# Altium project SAMR21_Xplained_Pro.PrjPCB (part 1 of 2)
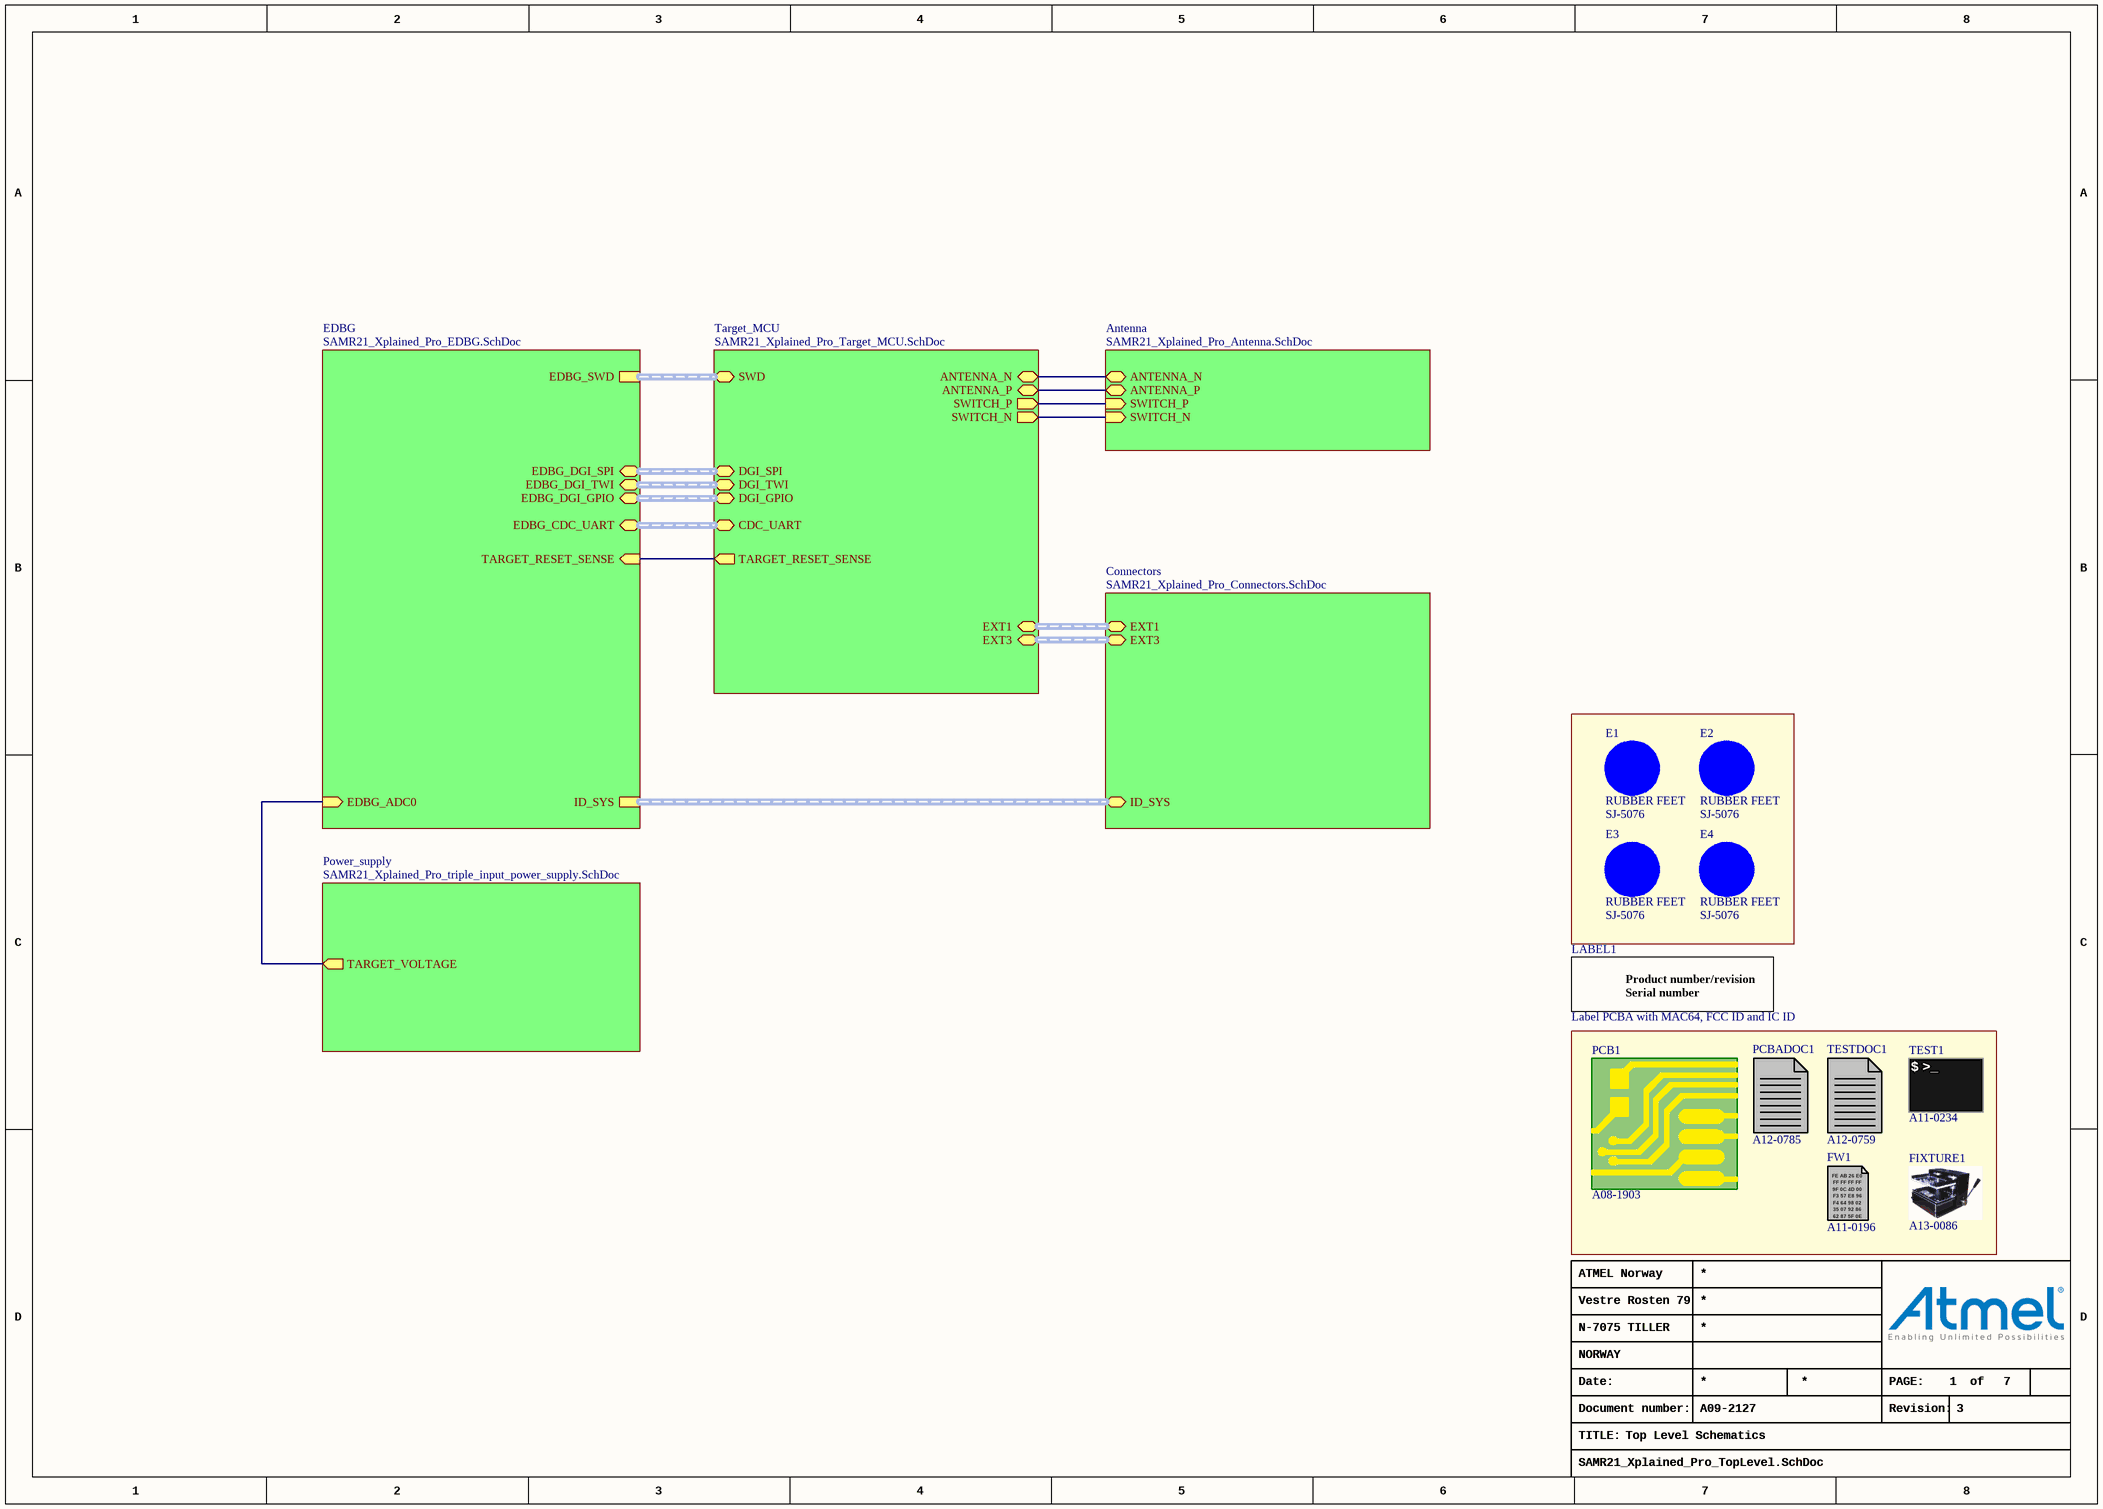
[diagram p0: SAMR21_Xplained_Pro_TopLevel.SchDoc]
7 sheets, 160 parts. Net scope: hierarchical (ports join the sheet entries above them; power ports are global).
Board file: SAMR21_Xplained_Pro.PcbDoc
Sheets:
  SAMR21_Xplained_Pro_TopLevel.SchDoc
    Target_MCU = SAMR21_Xplained_Pro_Target_MCU.SchDoc
      Crystals = SAMR21_Xplained_Pro_Crystals.SchDoc
    EDBG = SAMR21_Xplained_Pro_EDBG.SchDoc
    Connectors = SAMR21_Xplained_Pro_Connectors.SchDoc
    Power_supply = SAMR21_Xplained_Pro_triple_input_power_supply.SchDoc
    Antenna = SAMR21_Xplained_Pro_Antenna.SchDoc

## Sheet SAMR21_Xplained_Pro_TopLevel.SchDoc: Top Level Schematics
size A3; Organization: ATMEL Norway; Address1: Vestre Rosten 79; Address2: N-7075 TILLER; Address3: NORWAY; DocumentNumber: A09-2127; Revision: 3; SheetNumber: 1; SheetTotal: 7; PageSetup: Record=PageOptions|CenterHorizontal=True|CenterVertical=True|PrintScale=1.01|XCorrection=1.00|YCorrection=1.00|PrintKind=1|BorderSize=5000000|LeftOffset=0|BottomOffset=0|Orientation=2|PaperLength=1000|PaperWidth=1000|Scale=100|PaperSource=7|PrintQuality=-4|MediaType=1|DitherType=10|PaperKind=Letter|PrintScaleMode=1

### Parts
E1  RUBBER FEET  value SJ-5076  [AP8-00192]
E2  RUBBER FEET  value SJ-5076  [AP8-00192]
E3  RUBBER FEET  value SJ-5076  [AP8-00192]
E4  RUBBER FEET  value SJ-5076  [AP8-00192]
FIXTURE1  AN: A13-0086  (hidden comment: JIG)  (mechanical)
FW1  AN: A11-0196  (hidden comment: FW)  (mechanical)
LABEL1  value Label PCBA with MAC64, FCC ID and IC ID  [AP8-00317]  (hidden comment: PCBA_LABEL)
PCB1  AN: A08-1903  (hidden comment: PCB)  (mechanical)
PCBADOC1  AN: A12-0785  (hidden comment: PCBADOC)  (mechanical)
TEST1  AN: A11-0234  (hidden comment: TEST)  (mechanical)
TESTDOC1  AN: A12-0759  (hidden comment: TESTDOC)  (mechanical)

### Sub-sheets
Antenna = SAMR21_Xplained_Pro_Antenna.SchDoc: ANTENNA_N (bidir), ANTENNA_P (bidir), SWITCH_P (in), SWITCH_N (in)
Connectors = SAMR21_Xplained_Pro_Connectors.SchDoc: ID_SYS (harness ID_SYS), EXT1 (harness EXT), EXT3 (harness EXT)
EDBG = SAMR21_Xplained_Pro_EDBG.SchDoc: ID_SYS (harness ID_SYS), EDBG_SWD (harness SWD), EDBG_CDC_UART (harness CDC_UART), EDBG_DGI_TWI (harness DGI_TWI), EDBG_DGI_SPI (harness DGI_SPI), EDBG_DGI_GPIO (harness DGI_GPIO), TARGET_RESET_SENSE (in), EDBG_ADC0 (in)
Power_supply = SAMR21_Xplained_Pro_triple_input_power_supply.SchDoc: TARGET_VOLTAGE (out)
Target_MCU = SAMR21_Xplained_Pro_Target_MCU.SchDoc: SWD (harness SWD), DGI_SPI (harness DGI_SPI), DGI_TWI (harness DGI_TWI), DGI_GPIO (harness DGI_GPIO), CDC_UART (harness CDC_UART), TARGET_RESET_SENSE (out), EXT3 (harness EXT), EXT1 (harness EXT), ANTENNA_N (bidir), ANTENNA_P (bidir), SWITCH_P (out), SWITCH_N (out)

### Nets
EDBG_ADC0: sheet EDBG/EDBG_ADC0, sheet Power_supply/TARGET_VOLTAGE
PA09_RFCTRL1: sheet Target_MCU/SWITCH_N, sheet Antenna/SWITCH_N
PA12_RFCTRL2: sheet Target_MCU/SWITCH_P, sheet Antenna/SWITCH_P
RF_N: sheet Target_MCU/ANTENNA_N, sheet Antenna/ANTENNA_N
RF_P: sheet Target_MCU/ANTENNA_P, sheet Antenna/ANTENNA_P
TARGET_RESET_SENSE: sheet Target_MCU/TARGET_RESET_SENSE, sheet EDBG/TARGET_RESET_SENSE

Not connected (* = marked no-connect by the designer): E1 1(FIDUCIAL); E2 1(FIDUCIAL); E3 1(FIDUCIAL); E4 1(FIDUCIAL)

### Buses and harness runs
harness sheet Connectors/EXT1 = sheet Target_MCU/EXT1
harness sheet Connectors/EXT3 = sheet Target_MCU/EXT3
harness sheet Connectors/ID_SYS = sheet EDBG/ID_SYS
harness sheet EDBG/EDBG_CDC_UART = sheet Target_MCU/CDC_UART
harness sheet EDBG/EDBG_DGI_GPIO = sheet Target_MCU/DGI_GPIO
harness sheet EDBG/EDBG_DGI_SPI = sheet Target_MCU/DGI_SPI
harness sheet EDBG/EDBG_DGI_TWI = sheet Target_MCU/DGI_TWI
harness sheet EDBG/EDBG_SWD = sheet Target_MCU/SWD

### Notes on the sheet
- Date:
- PAGE:
- of
- TITLE:
- Document number:
- Revision:
- (in symbol A08-1911) / Product number/revision / Serial number
- (in symbol A11-0196) FE AB 26 E0; FF FF FF FF; 9F 0C 4D 00; F3 57 E8 96; F4 64 98 02; 35 07 92 86; 62 87 5F 0E
- (in symbol A11-0234) $ >_

### Library data of the parts
E1-E4 = A08-0053: 2.8mm adhesive feet,diam 8.0mm; PartGroup: Mechanical devices,Mounting accessories; Manufacturer: 3M; AN: A08-0053; Height: 2,79999995231628; MPN: SJ-5076
FIXTURE1 = A13-0086: Xplained PRO MCU board Jupiter Test Fixture; PartGroup: Test Equipment,Test Fixtures; Manufacturer: ESCATEC; Value: Xplained PRO MCU board Jupiter Test Fixture; MPN: Xplained PRO MCU board Jupiter Test Fixture
FW1 = A11-0196: EDBG secured firmware; PartGroup: Software,Firmware,Tools; Manufacturer: ATMEL; Value: EDBG secured firmware
LABEL1 = A08-1911: Label for use on wireless PCBA that needs 64 bit MAC, FCC ID and IC ID; PartGroup: Mechanical devices,Packaging materials,Printed Labels; Manufacturer: ACT Logimark AS; MPN: 505462; AN: A08-1911
PCB1 = A08-1903: SAMR21 Xplained Pro PCBA documentation; PartGroup: Mechanical devices,Printed circuit boards; Manufacturer: ATMEL; Value: SAMR21 Xplained Pro PCB documentation
PCBADOC1 = A12-0785: SAMR21 Xplained Pro PCBA documentation; PartGroup: Documentation,PCBA Documents,Atmel; Manufacturer: ATMEL; Value: A09-2127 PCBA Files
TEST1 = A11-0234: Fixture test for SAMR21 Xplained Pro; PartGroup: Software,Test software,Starter Kit; Manufacturer: ATMEL; Value: SAMR21 Xplained Pro test
TESTDOC1 = A12-0759: SAMR21 Xplained Pro test Instructions; PartGroup: Documentation,Procedures,Test Instructions; Manufacturer: ATMEL; Value: SAMR21 Xplained Pro test Instructions

## Sheet SAMR21_Xplained_Pro_Target_MCU.SchDoc: Target MCU
size A3; Organization: ATMEL Norway; Address1: Vestre Rosten 79; Address2: N-7075 TILLER; Address3: NORWAY; DocumentNumber: A09-2127; Revision: 3; SheetNumber: 2; SheetTotal: 7; PageSetup: Record=PageOptions|CenterHorizontal=True|CenterVertical=True|PrintScale=1.01|XCorrection=1.00|YCorrection=1.00|PrintKind=1|BorderSize=5000000|LeftOffset=0|BottomOffset=0|Orientation=2|PaperLength=1000|PaperWidth=1000|Scale=100|PaperSource=7|PrintQuality=-4|MediaType=1|DitherType=10|PaperKind=A3 (297 x 420 mm)|PrintScaleMode=1
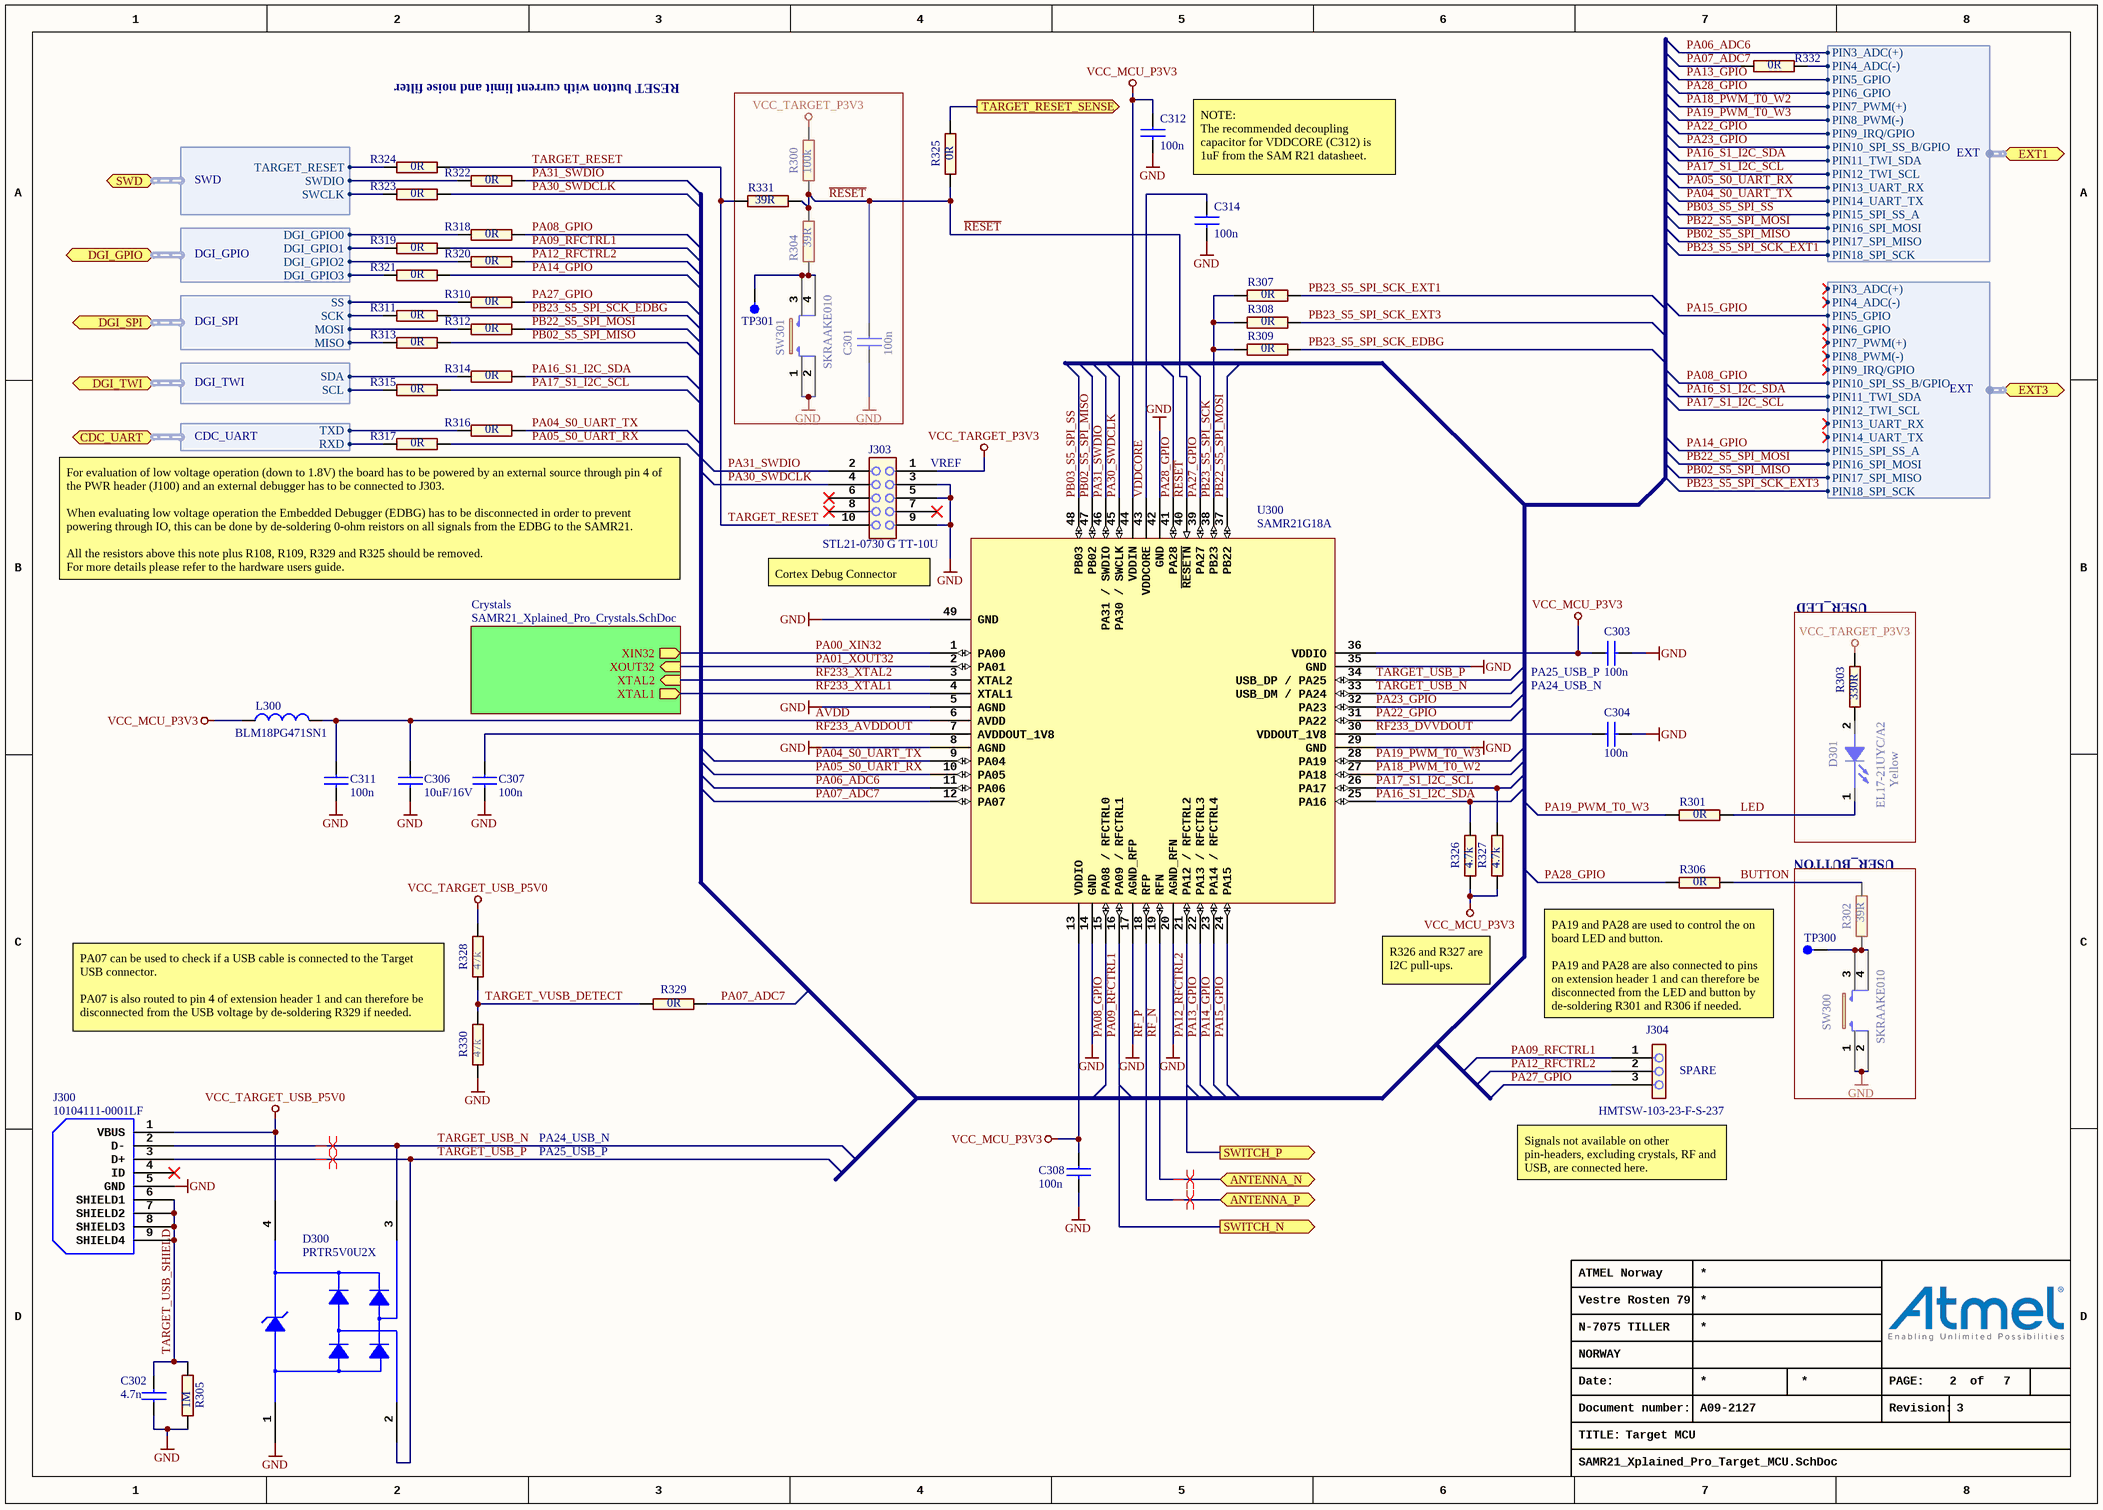
[diagram p1: SAMR21_Xplained_Pro_Target_MCU.SchDoc]

### Parts
C301  100n  [AP1-00053]
C302  value 4.7n  [AP1-00053]  (hidden comment: CAP-NONPOL)
C303  value 100n  [AP1-00001]  (hidden comment: CAP-NONPOL)
C304  value 100n  [AP1-00001]  (hidden comment: CAP-NONPOL)
C306  value 10uF/16V  [AP1-00039]  (hidden comment: CAP-NONPOL)
C307  value 100n  [AP1-00001]  (hidden comment: CAP-NONPOL)
C308  value 100n  [AP1-00001]  (hidden comment: CAP-NONPOL)
C311  value 100n  [AP1-00001]  (hidden comment: CAP-NONPOL)
C312  value 100n  [AP1-00001]  (hidden comment: CAP-NONPOL)
C314  value 100n  [AP1-00001]  (hidden comment: CAP-NONPOL)
D300  PRTR5V0U2X  [AP4-00001]
D301  Yellow  value EL17-21UYC/A2  [AP4-00013]
J300  value 10104111-0001LF  [AP8-00604]  (hidden comment: USB_AB)
J303  MPN: STL21-0730 G TT-10U  [AP8-00257]  (hidden comment: HEADER 2x5)
J304  value HMTSW-103-23-F-S-237  [AP8-00745]  (hidden comment: HEADER 1x3)
L300  value BLM18PG471SN1  [AP3-00005]  (hidden comment: INDUCTOR)
R300  value 100k  [AP2-00000]  (hidden comment: R2)
R301  value 0R  [AP2-00000]  (hidden comment: R2)
R302  value 39R  [AP2-00011]  (hidden comment: R2)
R303  value 330R  [AP2-00000]  (hidden comment: R2)
R304  value 39R  [AP2-00011]  (hidden comment: R2)
R305  value 1M  [AP2-00011]  (hidden comment: R2)
R306  value 0R  [AP2-00000]  (hidden comment: R2)
R307  value 0R  [AP2-00000]  (hidden comment: R2)
R308  value 0R  [AP2-00000]  (hidden comment: R2)
R309  value 0R  [AP2-00000]  (hidden comment: R2)
R310  value 0R  [AP2-00000]  (hidden comment: R2)
R311  value 0R  [AP2-00000]  (hidden comment: R2)
R312  value 0R  [AP2-00000]  (hidden comment: R2)
R313  value 0R  [AP2-00000]  (hidden comment: R2)
R314  value 0R  [AP2-00000]  (hidden comment: R2)
R315  value 0R  [AP2-00000]  (hidden comment: R2)
R316  value 0R  [AP2-00000]  (hidden comment: R2)
R317  value 0R  [AP2-00000]  (hidden comment: R2)
R318  value 0R  [AP2-00000]  (hidden comment: R2)
R319  value 0R  [AP2-00000]  (hidden comment: R2)
R320  value 0R  [AP2-00000]  (hidden comment: R2)
R321  value 0R  [AP2-00000]  (hidden comment: R2)
R322  value 0R  [AP2-00000]  (hidden comment: R2)
R323  value 0R  [AP2-00000]  (hidden comment: R2)
R324  value 0R  [AP2-00000]  (hidden comment: R2)
R325  value 0R  [AP2-00000]  (hidden comment: R2)
R326  value 4.7k  [AP2-00000]  (hidden comment: R2)
R327  value 4.7k  [AP2-00000]  (hidden comment: R2)
R328  value 47k  [AP2-00000]  (hidden comment: R2)
R329  value 0R  [AP2-00000]  (hidden comment: R2)
R330  value 47k  [AP2-00000]  (hidden comment: R2)
R331  value 39R  [AP2-00011]  (hidden comment: R2)
R332  value 0R  [AP2-00000]  (hidden comment: R2)
SW300  value SKRAAKE010  [AP8-00137]  (hidden comment: Can be ordered in low volumes from Mouser)
SW301  value SKRAAKE010  [AP8-00137]  (hidden comment: Can be ordered in low volumes from Mouser)
TP300  TESTPOINT  [AP8-00010]  (value not drawn)  (no BOM)
TP301  TESTPOINT  [AP8-00010]  (value not drawn)  (no BOM)
U300  value SAMR21G18A  [AP6-00171]  (hidden comment: SAMR21G)

### Blocks framed on the sheet
USER_LED: D301 R303
USER_BUTTON: R302 SW300 TP300

### Sub-sheets
Crystals = SAMR21_Xplained_Pro_Crystals.SchDoc: XOUT32 (in), XIN32 (out), XTAL1 (out), XTAL2 (in)

### Ports
ANTENNA_N (bidir), ANTENNA_P (bidir), CDC_UART (harness CDC_UART), DGI_GPIO (harness DGI_GPIO), DGI_SPI (harness DGI_SPI), DGI_TWI (harness DGI_TWI), EXT1 (harness EXT), EXT3 (harness EXT), SWD (harness SWD), SWITCH_N (out), SWITCH_P (out), TARGET_RESET_SENSE (out)

### Harnesses
DGI_GPIO: DGI_GPIO0, DGI_GPIO1, DGI_GPIO2, DGI_GPIO3
DGI_SPI: MISO, MOSI, SCK, SS
DGI_TWI: SCL, SDA
CDC_UART: RXD, TXD
EXT: PIN10_SPI_SS_B/GPIO, PIN11_TWI_SDA, PIN12_TWI_SCL, PIN13_UART_RX, PIN14_UART_TX, PIN15_SPI_SS_A, PIN16_SPI_MOSI, PIN17_SPI_MISO, PIN18_SPI_SCK, PIN3_ADC(+), PIN4_ADC(-), PIN5_GPIO, PIN6_GPIO, PIN7_PWM(+), PIN8_PWM(-), PIN9_IRQ/GPIO
SWD: SWCLK, SWDIO, TARGET_RESET

### Nets
GND: C301.2 C302.1 C303.2 C304.2 C306.2 C307.2 C308.2 C311.2 C312.2 C314.2 D300.1(GND) J300.5(GND) J303.3 J303.5 J303.9 R305.1 R330.1 SW300.1 SW300.2 SW301.1 SW301.2 U300.5(AGND) U300.8(AGND) U300.14(GND) U300.17(AGND_RFP) U300.20(AGND_RFN) U300.29(GND) U300.35(GND) U300.42(GND) U300.49(GND)
VCC_MCU_P3V3: C303.1 C308.1 C312.1 L300.1 R326.1 R327.1 U300.13(VDDIO) U300.36(VDDIO) U300.44(VDDIN)
VCC_TARGET_P3V3: J303.1 R300.2 R303.2
VCC_TARGET_USB_P5V0: D300.4(VCC) J300.1(VBUS) R328.2
AVDD: C306.1 C311.1 L300.2 U300.6(AVDD)
BUTTON: R302.2 R306.2
EDBG_CDC_USART_RX: R316.1 ; port CDC_UART.TXD
EDBG_DGI_SCL: R315.1 ; port DGI_TWI.SCL
EDBG_DGI_SDA: R314.1 ; port DGI_TWI.SDA
EDBG_SPI_DGI_MOSI: R312.1 ; port DGI_SPI.MOSI
EDBG_SPI_DGI_SCK: R311.1 ; port DGI_SPI.SCK
EDBG_SPI_DGI_SS: R310.1 ; port DGI_SPI.SS
LED: D301.1(CATHODE) R301.2
PA00_XIN32: U300.1(PA00) ; sheet Crystals/XIN32
PA01_XOUT32: U300.2(PA01) ; sheet Crystals/XOUT32
PA04_S0_UART_TX: R316.2 U300.9(PA04) ; port EXT1.PIN14_UART_TX
PA05_S0_UART_RX: R317.2 U300.10(PA05) ; port EXT1.PIN13_UART_RX
PA06_ADC6: U300.11(PA06) ; port EXT1.PIN3_ADC(+)
PA07_ADC7: R329.2 R332.1 U300.12(PA07)
PA08_GPIO: R318.2 U300.15(PA08_/_RFCTRL0) ; port EXT3.PIN10_SPI_SS_B/GPIO
PA09_RFCTRL1: J304.1 R319.2 U300.16(PA09_/_RFCTRL1) ; port SWITCH_N
PA12_RFCTRL2: J304.2 R320.2 U300.21(PA12_/_RFCTRL2) ; port SWITCH_P
PA13_GPIO: U300.22(PA13_/_RFCTRL3) ; port EXT1.PIN5_GPIO
PA14_GPIO: R321.2 U300.23(PA14_/_RFCTRL4) ; port EXT3.PIN15_SPI_SS_A
PA15_GPIO: U300.24(PA15) ; port EXT3.PIN5_GPIO
PA16_S1_I2C_SDA: R314.2 R326.2 U300.25(PA16) ; port EXT1.PIN11_TWI_SDA, port EXT3.PIN11_TWI_SDA
PA17_S1_I2C_SCL: R315.2 R327.2 U300.26(PA17) ; port EXT1.PIN12_TWI_SCL, port EXT3.PIN12_TWI_SCL
PA18_PWM_T0_W2: U300.27(PA18) ; port EXT1.PIN7_PWM(+)
PA19_PWM_T0_W3: R301.1 U300.28(PA19) ; port EXT1.PIN8_PWM(-)
PA22_GPIO: U300.31(PA22) ; port EXT1.PIN9_IRQ/GPIO
PA23_GPIO: U300.32(PA23) ; port EXT1.PIN10_SPI_SS_B/GPIO
PA27_GPIO: J304.3 R310.2 U300.39(PA27)
PA28_GPIO: R306.1 U300.41(PA28) ; port EXT1.PIN6_GPIO
PA30_SWDCLK: J303.4 R323.2 U300.45(PA30_/_SWCLK)
PA31_SWDIO: J303.2 R322.2 U300.46(PA31_/_SWDIO)
PB02_S5_SPI_MISO: R313.2 U300.47(PB02) ; port EXT1.PIN17_SPI_MISO, port EXT3.PIN17_SPI_MISO
PB03_S5_SPI_SS: U300.48(PB03) ; port EXT1.PIN15_SPI_SS_A
PB22_S5_SPI_MOSI: R312.2 U300.37(PB22) ; port EXT1.PIN16_SPI_MOSI, port EXT3.PIN16_SPI_MOSI
PB23_S5_SPI_SCK: R307.1 R308.1 R309.1 U300.38(PB23)
PB23_S5_SPI_SCK_EDBG: R309.2 R311.2
PB23_S5_SPI_SCK_EXT1: R307.2 ; port EXT1.PIN18_SPI_SCK
PB23_S5_SPI_SCK_EXT3: R308.2 ; port EXT3.PIN18_SPI_SCK
~{RESET}: C301.1 R300.1 R304.2 R325.1 R331.2 U300.40(~{RESETN})
RF233_AVDDOUT: C307.1 U300.7(AVDDOUT_1V8)
RF233_DVVDOUT: C304.1 U300.30(VDDOUT_1V8)
RF233_XTAL1: U300.4(XTAL1) ; sheet Crystals/XTAL1
RF233_XTAL2: U300.3(XTAL2) ; sheet Crystals/XTAL2
RF_N: U300.19(RFN) ; port ANTENNA_N
RF_P: U300.18(RFP) ; port ANTENNA_P
SWCLK: R323.1 ; port SWD.SWCLK
SWDIO: R322.1 ; port SWD.SWDIO
TARGET_RESET: J303.10 R324.2 R331.1
TARGET_RESET_EDBG: R324.1 ; port SWD.TARGET_RESET
TARGET_RESET_SENSE: R325.2 ; port TARGET_RESET_SENSE
TARGET_USB_N: D300.3(I/O_2) J300.2(D-) U300.33(USB_DM_/_PA24)
TARGET_USB_P: D300.2(I/O_1) J300.3(D+) U300.34(USB_DP_/_PA25)
TARGET_USB_SHIELD: C302.2 J300.6(SHIELD1) J300.7(SHIELD2) J300.8(SHIELD3) J300.9(SHIELD4) R305.2
TARGET_VUSB_DETECT: R328.1 R329.1 R330.2
VDDCORE: C314.1 U300.43(VDDCORE)
NetD301_2: D301.2(ANODE) R303.1
NetJ200_4: R332.2 ; port EXT1.PIN4_ADC(-)
NetR302_1: R302.1 SW300.3 SW300.4 TP300.1
NetR304_1: R304.1 SW301.3 SW301.4 TP301.1
NetR313_1: R313.1 ; port DGI_SPI.MISO
NetR317_1: R317.1 ; port CDC_UART.RXD
NetR318_1: R318.1 ; port DGI_GPIO.DGI_GPIO0
NetR319_1: R319.1 ; port DGI_GPIO.DGI_GPIO1
NetR320_1: R320.1 ; port DGI_GPIO.DGI_GPIO2
NetR321_1: R321.1 ; port DGI_GPIO.DGI_GPIO3

Not connected (* = marked no-connect by the designer): J300 4(ID)*; J303 6* 7* 8*

### Layout directives
differential pair: RF_N, RF_P, TARGET_USB_N, TARGET_USB_P

### Notes on the sheet
- RESET button with current limit and noise filter
- NOTE:
  The recommended decoupling capacitor for VDDCORE (C312) is 1uF from the SAM R21 datasheet.
- (near J303) VREF
- (near R317) For evaluation of low voltage operation (down to 1.8V) the board has to be powered by an external source through pin 4 of the PWR header (J100) and an external debugger has to be connected to J303.
  When evaluating low voltage operation the Embedded Debugger (EDBG) has to be disconnected in order to prevent powering through IO, this can be done by de-soldering 0-ohm reistors on all signals from the EDBG to the SAMR21.
  All the resistors above this note plus R108, R109, R329 and R325 should be removed.
  For more details please refer to the hardware users guide.
- Cortex Debug Connector
- (near C303) PA25_USB_P
- PA24_USB_N
- R326 and R327 are I2C pull-ups.
- PA07 can be used to check if a USB cable is connected to the Target USB connector.
  PA07 is also routed to pin 4 of extension header 1 and can therefore be disconnected from the USB voltage by de-soldering R329 if needed.
- PA19 and PA28 are used to control the on board LED and button.
  PA19 and PA28 are also connected to pins on extension header 1 and can therefore be disconnected from the LED and button by de-soldering R301 and R306 if needed.
- (near J304) SPARE
- PA25_USB_P
- (near J304) Signals not available on other pin-headers, excluding crystals, RF and USB, are connected here.
- Date:
- PAGE:
- of
- TITLE:
- Document number:
- Revision:

### Library data of the parts
C301 C303 C304 C307 C308 C311 C312 C314 = A01-0246: Ceramic capacitor, SMD 0402, X7R, 16V, +/-10%; PartGroup: Capacitors,Ceramic,SMD 0402; Manufacturer: Kemet; MPN: C0402C104K4RACTU; TemperatureRange: -55 - +125 deg C; AN: A01-0246; Tolerance: 16V, +/-10%; Height: 0,5
  C301: Value: 100n
C302 = A01-0046: Ceramic capacitor, SMD 0402, X7R, 25V, +/-10%; PartGroup: Capacitors,Ceramic,SMD 0402; TemperatureRange: -55 - +125 deg C; AN: A01-0046; Tolerance: 25V, +/-10%; Height: 0.550000011920929
C306 = A01-0491: Ceramic capacitor, SMD 0603, X5R, 16V, 10UF ± 20% (High Density); PartGroup: Capacitors,Ceramic,SMD 0603; Manufacturer: Taiyo Yuden; MPN: EMK107BBJ106MA-T; AN: A01-0491
D300 = A06-0236: Double rail-to-rail USB ESD protection diode; OrcadPartType: Integrated Circuits&Special function&Protection; Manufacturer: Philips; TemperatureRange: -40 to +85 C; AN: A06-0236; Value: PRTR5V0U2X; PartType: Buy; Height: 1,10000002384186; MPN: PRTR5V0U2X
D301 = A10-0019: LED, Yellow, Wave length=591nm, SMD 0805, ±70°; PartGroup: Opto,LEDs,SMD; Manufacturer: Everlight; MPN: 17-21UYC/S530-A3/TR8; TemperatureRange: -40 to +85 deg C; AN: A10-0019; Height: 1,10000002384186
J300 = A08-1368: Micro USB AB Connector; PartGroup: Mechanical devices,Connectors,USB; Manufacturer: FCI; AN: A08-1368; Height: 2.59999990463257; MPN: 10104111-0001LF
J303 = A08-0385: 2x5 pin header, 1.27mm pitch, THM; PartGroup: Mechanical devices,Connectors,Pin headers; Manufacturer: Garry; Value: PIN HEADER 2x5; AN: A08-0385; Height: 7.30000019073486
J304 = A08-1799: 1x3 pin header, 2.54mm pitch, Pin-in-Paste THM, 1mm hole; AN: A08-1799
L300 = A03-0035: SMD RF inductor 0603. Z=470Ohm (@100MHz), Max R(dc)=0.65Ohm, Max current=1A; PartGroup: Inductors,EMI; Manufacturer: Murata; Tolerance: ±25%; TemperatureRange: -55°C to +125°C; AN: A03-0035; Height: 0,800000011920929; MPN: BLM18PG471SN1
R300 = A02-0260: Thick film resistor, SMD 0402, 1/16W, 1%; PartGroup: Resistors,SMD,0402 1%; TemperatureRange: -55 - +125 deg C; AN: A02-0260; Tolerance: 1 %; Height: 0,349999994039536
R301 R306-R325 R329 R332 = A02-0163: RES 0.0 OHM 1/16W 0402 SMD; PartGroup: Resistors,SMD,0402 1%; MPN: RMCF0402ZT0R00; Tolerance: 1 %; TemperatureRange: -55 - +125 deg C; AN: A02-0163; Height: 0,349999994039536
R302 R304 R331 = A02-0178: Thick film resistor, SMD 0402, 1/16W, 1%; PartGroup: Resistors,SMD,0402 1%; TemperatureRange: -55 - +125 deg C; AN: A02-0178; Tolerance: 1 %; Height: 0,349999994039536
R303 = A02-0200: Thick film resistor, SMD 0402, 1/16W, 1%; PartGroup: Resistors,SMD,0402 1%; TemperatureRange: -55 - +125 deg C; AN: A02-0200; Tolerance: 1 %; Height: 0.349999994039536
R305 = A02-0284: Thick film resistor, SMD 0402, 1/16W, 1%; PartGroup: Resistors,SMD,0402 1%; Manufacturer: KOA; MPN: RK73H1ETTP1004F; TemperatureRange: -55 - +125 deg C; AN: A02-0284; Tolerance: 1 %; Height: 0,349999994039536
R326 R327 = A02-0228: Thick film resistor, SMD 0402, 1/16W, 1%; PartGroup: Resistors,SMD,0402 1%; TemperatureRange: -55ï¿½ to +125ï¿½C; AN: A02-0228; Tolerance: 1 %; Height: 0,349999994039536
R328 R330 = A02-0252: Thick film resistor, SMD 0402, 1/16W, 1%; PartGroup: Resistors,SMD,0402 1%; TemperatureRange: -55 - +125 deg C; AN: A02-0252; Tolerance: 1 %; Height: 0.349999994039536
SW300 SW301 = A08-0790: 6.2x6.2 mm SMD tact switch, same as A08-0091 but less force is needed; PartGroup: Mechanical devices,Switches,SMD; Manufacturer: ALPS; TemperatureRange: -30 - +90 deg C; AN: A08-0790; Height: 5,09999990463257; MPN: SKRAAKE010
TP300 TP301 = A08-0004: Single SMD testpad; PartGroup: Mechanical devices,Connectors,Test points; AN: A08-0004; Height: 0
U300 = A06-1046: Atmel 32-bit Cortex M0+ MCU with RF233 SIP.; PartGroup: Integrated Circuits,MCU, MPU, DSP,ARM MCU; MPN: SAMR21G18A-MUT; TemperatureRange: -40 to +85 deg celcius; AN: A06-1046; Height: 0,850000023841858; Manufacturer: ATMEL

## Sheet SAMR21_Xplained_Pro_Crystals.SchDoc: Target Peripherals
size A3; Organization: ATMEL Norway; Address1: Vestre Rosten 79; Address2: N-7075 TILLER; Address3: NORWAY; DocumentNumber: A09-2127; Revision: 3; SheetNumber: 3; SheetTotal: 7; PageSetup: Record=PageOptions|CenterHorizontal=True|CenterVertical=True|PrintScale=1.01|XCorrection=1.00|YCorrection=1.00|PrintKind=1|BorderSize=5000000|LeftOffset=0|BottomOffset=0|Orientation=2|PaperLength=1000|PaperWidth=1000|Scale=100|PaperSource=7|PrintQuality=-4|MediaType=1|DitherType=10|PaperKind=A3 (297 x 420 mm)|PrintScaleMode=1
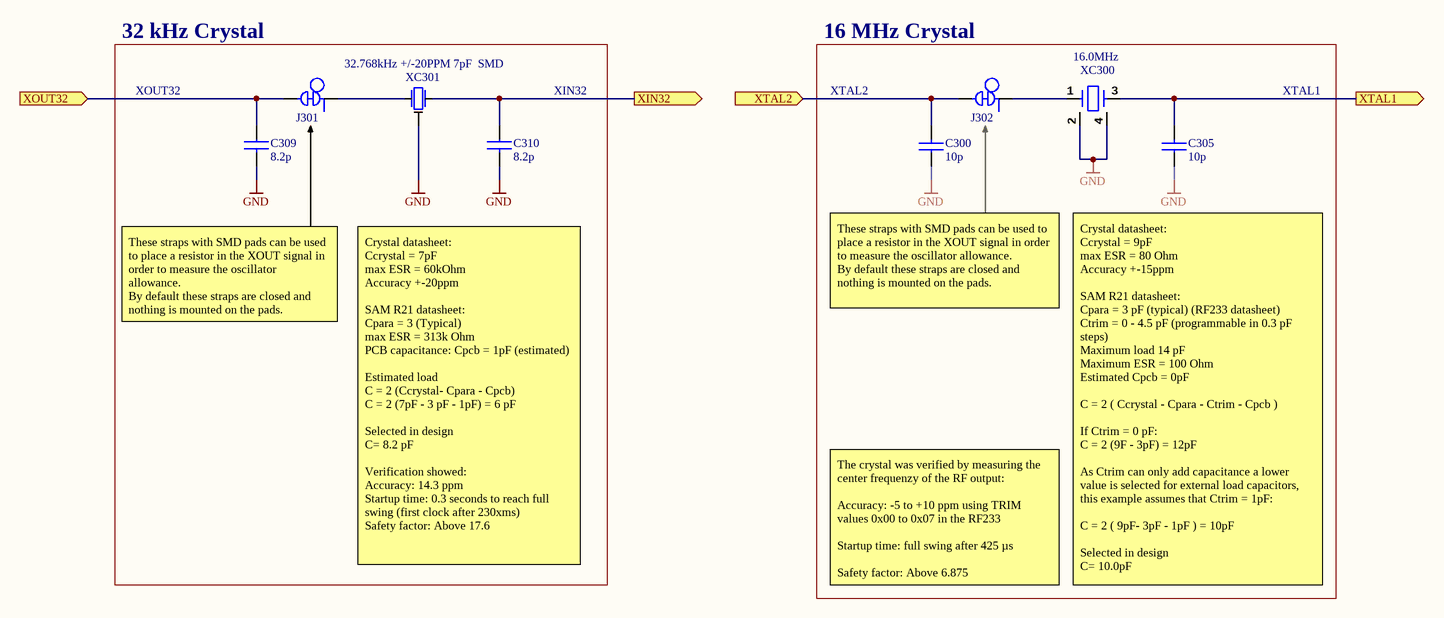
[diagram p2: SAMR21_Xplained_Pro_Crystals.SchDoc]

### Parts
C300  value 10p  [AP1-00001]  (hidden comment: CAP-NONPOL)
C305  value 10p  [AP1-00001]  (hidden comment: CAP-NONPOL)
C309  value 8.2p  [AP1-00001]  (hidden comment: CAP-NONPOL)
C310  value 8.2p  [AP1-00001]  (hidden comment: CAP-NONPOL)
J301  SMD-STRAP_CLOSED  [AP8-00595]  (value not drawn)  (net tie, no BOM)
J302  SMD-STRAP_CLOSED  [AP8-00595]  (value not drawn)  (net tie, no BOM)
XC300  value 16.0MHz  [AP7-00061]  (hidden comment: TSX-3225)
XC301  value 32.768kHz +/-20PPM 7pF  SMD  [AP7-00044]  (hidden comment: Farnell order no:1539364)

### Blocks framed on the sheet
32 kHz Crystal: C309 C310 J301 XC301
16 MHz Crystal: C300 C305 J302 XC300

### Ports
XIN32 (out), XOUT32 (in), XTAL1 (out), XTAL2 (in)

### Nets
GND: C300.1 C305.1 C309.2 C310.2 XC300.2(GND) XC300.4(GND) XC301.3
PA00_XIN32: C310.1 XC301.2 ; port XIN32
PA01_XOUT32: C309.1 J301.2 ; port XOUT32
RF233_XTAL1: C305.2 XC300.3(OUT) ; port XTAL1
RF233_XTAL2: C300.2 J302.2 ; port XTAL2
NetJ301_1: J301.1 XC301.1
NetJ302_1: J302.1 XC300.1(IN)

### Notes on the sheet
- XOUT32
- XIN32
- XTAL2
- XTAL1
- These straps with SMD pads can be used to place a resistor in the XOUT signal in order to measure the oscillator allowance.
  By default these straps are closed and nothing is mounted on the pads.
- Crystal datasheet:
  Ccrystal = 7pF
  max ESR = 60kOhm
  Accuracy +-20ppm
  SAM R21 datasheet:
  Cpara = 3 (Typical)
  max ESR = 313k Ohm
  PCB capacitance: Cpcb = 1pF (estimated)
  Estimated load
  C = 2 (Ccrystal- Cpara - Cpcb)
  C = 2 (7pF - 3 pF - 1pF) = 6 pF
  Selected in design
  C= 8.2 pF
  Verification showed:
  Accuracy: 14.3 ppm
  Startup time: 0.3 seconds to reach full swing (first clock after 230xms)
  Safety factor: Above 17.6
- The crystal was verified by measuring the center frequenzy of the RF output:
  Accuracy: -5 to +10 ppm using TRIM values 0x00 to 0x07 in the RF233
  Startup time: full swing after 425 µs
  Safety factor: Above 6.875
- Crystal datasheet:
  Ccrystal = 9pF
  max ESR = 80 Ohm
  Accuracy +-15ppm
  SAM R21 datasheet:
  Cpara = 3 pF (typical) (RF233 datasheet)
  Ctrim = 0 - 4.5 pF (programmable in 0.3 pF steps)
  Maximum load 14 pF
  Maximum ESR = 100 Ohm
  Estimated Cpcb = 0pF
  C = 2 ( Ccrystal - Cpara - Ctrim - Cpcb )
  If Ctrim = 0 pF:
  C = 2 (9F - 3pF) = 12pF
  As Ctrim can only add capacitance a lower value is selected for external load capacitors, this example assumes that Ctrim = 1pF:
  C = 2 ( 9pF- 3pF - 1pF ) = 10pF
  Selected in design
  C= 10.0pF
- Date:
- PAGE:
- of
- TITLE:
- Document number:
- Revision:

### Library data of the parts
C300 C305 = A01-0015: Ceramic capacitor, SMD 0402, NP0, 50V, +/-5%; PartGroup: Capacitors,Ceramic,SMD 0402; TemperatureRange: -55 - +125 deg C; AN: A01-0015; Tolerance: 50V, +/-5%; Height: 0,550000011920929
C309 C310 = A01-0014: Ceramic capacitor, SMD 0402, NP0, 50V, +/-5%; PartGroup: Capacitors,Ceramic,SMD 0402; TemperatureRange: -55 - +125 deg C; AN: A01-0014; Tolerance: 50V, +/-5%; Height: 0.550000011920929
J301 J302 = A08-1454: Closed Link 0402; PartGroup: Mechanical devices,PCB implemented components; AN: A08-1454; Value: Closed Link
XC300 = A07-0078: 16MHz uXtal, 3.2 x 2.5 mm SMD, CL=9pF, 15PPM, ESR=80ohm(Max.; PartGroup: Frequency devices,Crystals,SMD; Manufacturer: Epson Toyocom; MPN: TSX-3225 16.0000MF09Z-AC3; TemperatureRange: -40°C to +85°C; AN: A07-0078; Tolerance: 15ppm; Height: 0,699999988079071
XC301 = A07-0052: 32k768 crystal, +-20ppm, CL=7pF, max ESR 60kOhm, SMD; PartGroup: Frequency devices,Crystals,SMD; Manufacturer: Micro Crystal; MPN: MS1V-T1K 32.768kHz 7pF +/-20PPM TA; Tolerance: +/- 20 PPM; TemperatureRange: -40 /+85; AN: A07-0052; Height: 2,07999992370605

## Sheet SAMR21_Xplained_Pro_EDBG.SchDoc: Embedded Debugger (EDBG)
size A3; Organization: ATMEL Norway; Address1: Vestre Rosten 79; Address2: N-7075 TILLER; Address3: NORWAY; DocumentNumber: A09-2127; Revision: 3; SheetNumber: 7; SheetTotal: 7; PageSetup: Record=PageOptions|CenterHorizontal=True|CenterVertical=True|PrintScale=0.73|XCorrection=1.00|YCorrection=1.00|PrintKind=1|BorderSize=5000000|LeftOffset=0|BottomOffset=0|Orientation=2|PaperLength=1000|PaperWidth=1000|Scale=100|PaperSource=7|PrintQuality=-4|MediaType=1|DitherType=10|PaperKind=A3 (297 x 420 mm)|PrintScaleMode=1
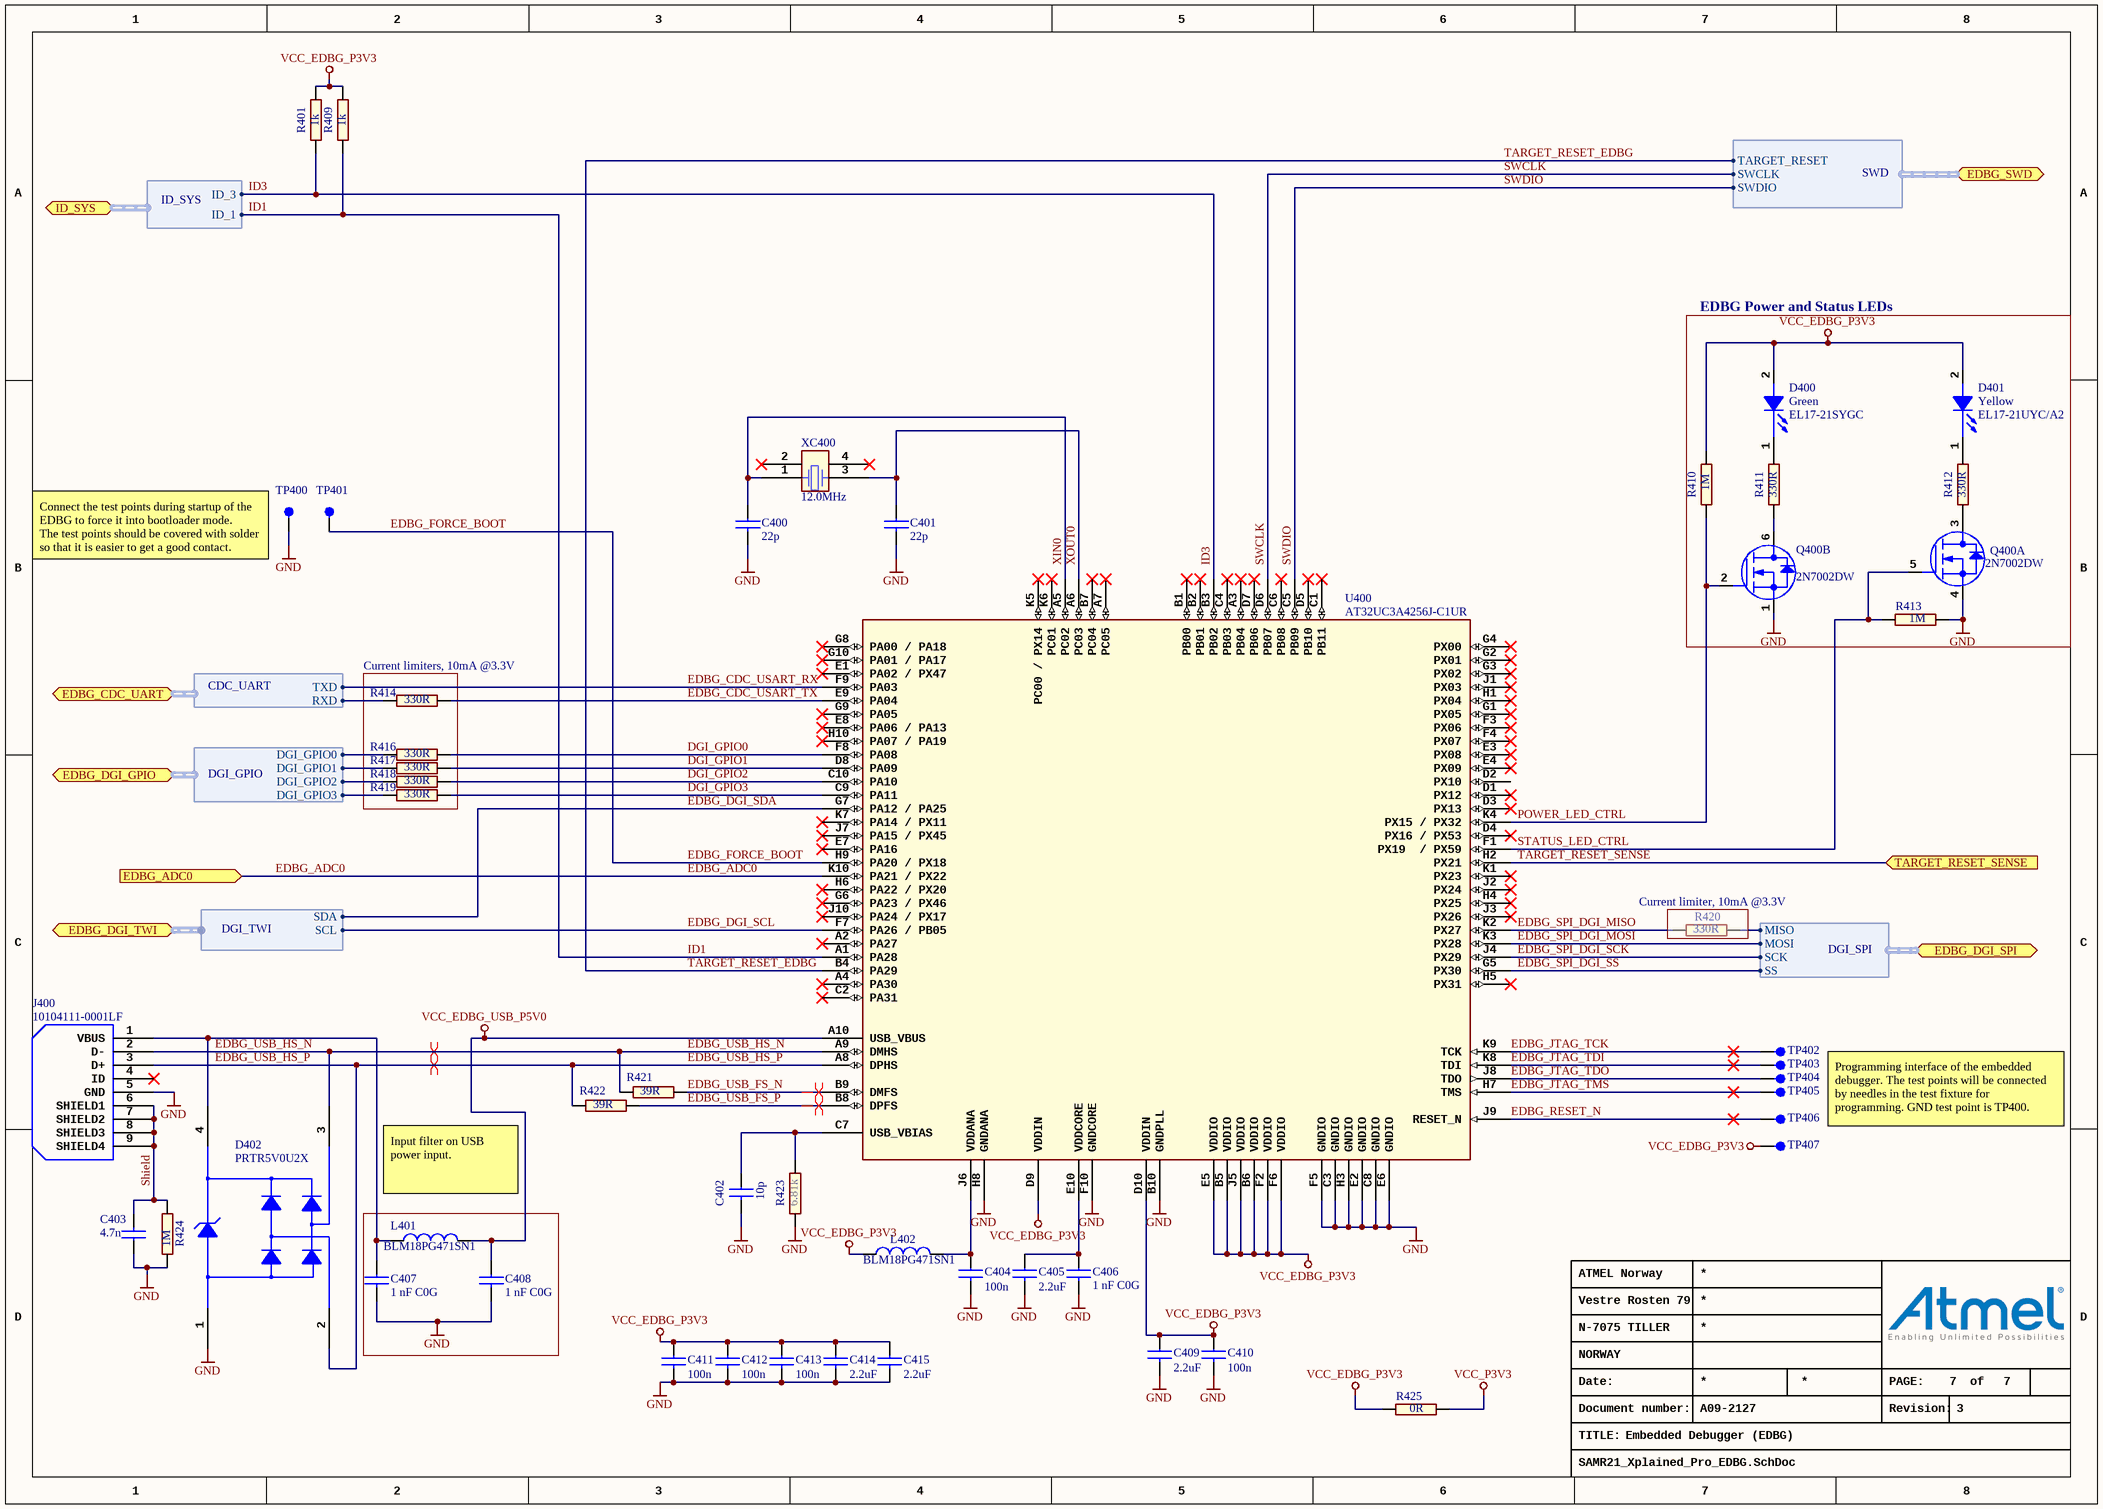
[diagram p3: SAMR21_Xplained_Pro_EDBG.SchDoc]

### Parts
C400  22p  [AP1-00053]
C401  22p  [AP1-00053]
C402  10p  [AP1-00053]
C403  value 4.7n  [AP1-00053]  (hidden comment: CAP-NONPOL)
C404  100n  [AP1-00053]
C405  value 2.2uF  [AP1-00053]  (hidden comment: Farnell no: 1288200)
C406  1 nF C0G  [AP1-00053]
C407  1 nF C0G  [AP1-00053]
C408  1 nF C0G  [AP1-00053]
C409  value 2.2uF  [AP1-00053]  (hidden comment: Farnell no: 1288200)
C410  100n  [AP1-00053]
C411  100n  [AP1-00053]
C412  100n  [AP1-00053]
C413  100n  [AP1-00053]
C414  value 2.2uF  [AP1-00053]  (hidden comment: Farnell no: 1288200)
C415  value 2.2uF  [AP1-00053]  (hidden comment: Farnell no: 1288200)
D400  Green  value EL17-21SYGC  [AP4-00013]
D401  Yellow  value EL17-21UYC/A2  [AP4-00013]
D402  PRTR5V0U2X  [AP4-00001]
J400  value 10104111-0001LF  [AP8-00604]  (hidden comment: USB_AB)
L401  BLM18PG471SN1  [AP3-00005]
L402  BLM18PG471SN1  [AP3-00005]
Q400  value 2N7002DW  [AP5-00001]  (hidden comment: Same as 2N7002 but with two MOSFETs in one package)  (parts A,B of 2)
R401  value 1k  [AP2-00000]  (hidden comment: R2)
R409  value 1k  [AP2-00000]  (hidden comment: R2)
R410  value 1M  [AP2-00000]  (hidden comment: R2)
R411  value 330R  [AP2-00000]  (hidden comment: R2)
R412  value 330R  [AP2-00000]  (hidden comment: R2)
R413  value 1M  [AP2-00000]  (hidden comment: R2)
R414  value 330R  [AP2-00000]  (hidden comment: R2)
R416  value 330R  [AP2-00000]  (hidden comment: R2)
R417  value 330R  [AP2-00000]  (hidden comment: R2)
R418  value 330R  [AP2-00000]  (hidden comment: R2)
R419  value 330R  [AP2-00000]  (hidden comment: R2)
R420  value 330R  [AP2-00000]  (hidden comment: R2)
R421  value 39R  [AP2-00011]  (hidden comment: R2)
R422  value 39R  [AP2-00011]  (hidden comment: R2)
R423  value 6.81k  [AP2-00011]  (hidden comment: R2)
R424  value 1M  [AP2-00011]  (hidden comment: R2)
R425  value 0R  [AP2-00000]  (hidden comment: R2)
TP400  TESTPOINT  [AP8-00010]  (value not drawn)  (no BOM)
TP401  TESTPOINT  [AP8-00010]  (value not drawn)  (no BOM)
TP402  TESTPOINT  [AP8-00010]  (value not drawn)  (no BOM)
TP403  TESTPOINT  [AP8-00010]  (value not drawn)  (no BOM)
TP404  TESTPOINT  [AP8-00010]  (value not drawn)  (no BOM)
TP405  TESTPOINT  [AP8-00010]  (value not drawn)  (no BOM)
TP406  TESTPOINT  [AP8-00010]  (value not drawn)  (no BOM)
TP407  TESTPOINT  [AP8-00010]  (value not drawn)  (no BOM)
U400  value AT32UC3A4256J-C1UR  [AP6-00206]  (hidden comment: 100 ball VFBGA)
XC400  12.0MHz  [AP7-00039]

### Blocks framed on the sheet
EDBG Power and Status LEDs: D400 D401 Q400 R410-R413
Current limiters, 10mA @3.3V: R414 R416-R419

### Ports
EDBG_ADC0 (in), EDBG_CDC_UART (harness CDC_UART), EDBG_DGI_GPIO (harness DGI_GPIO), EDBG_DGI_SPI (harness DGI_SPI), EDBG_DGI_TWI (harness DGI_TWI), EDBG_SWD (harness SWD), ID_SYS (harness ID_SYS), TARGET_RESET_SENSE (in)

### Harnesses
CDC_UART: TXD, RXD
DGI_SPI: MISO, MOSI, SCK, SS
DGI_GPIO: DGI_GPIO0, DGI_GPIO1, DGI_GPIO2, DGI_GPIO3
ID_SYS: ID_1, ID_3
SWD: SWCLK, SWDIO, TARGET_RESET
DGI_TWI: SCL, SDA

### Nets
GND: C400.2 C401.2 C402.2 C403.1 C404.2 C405.2 C406.2 C407.2 C408.2 C409.2 C410.2 C411.2 C412.2 C413.2 C414.2 C415.2 D402.1(GND) J400.5(GND) Q400.1(S2) Q400.4(S1) R413.1 R423.1 R424.1 TP400.1 U400.B10(GNDPLL) U400.C3(GNDIO) U400.C8(GNDIO) U400.E2(GNDIO) U400.E6(GNDIO) U400.F5(GNDIO) U400.F10(GNDCORE) U400.H3(GNDIO) U400.H8(GNDANA)
VCC_EDBG_P3V3: C409.1 C410.1 C411.1 C412.1 C413.1 C414.1 C415.1 D400.2(ANODE) D401.2(ANODE) L402.1 R401.2 R409.2 R410.2 R425.1 TP407.1 U400.B5(VDDIO) U400.B6(VDDIO) U400.D9(VDDIN) U400.D10(VDDIN) U400.E5(VDDIO) U400.F2(VDDIO) U400.F6(VDDIO) U400.J5(VDDIO)
VCC_EDBG_USB_P5V0: C408.1 L401.2 U400.A10(USB_VBUS)
VCC_P3V3: R425.2
DGI_GPIO0: R416.2 U400.F8(PA08)
DGI_GPIO1: R417.2 U400.D8(PA09)
DGI_GPIO2: R418.2 U400.C10(PA10)
DGI_GPIO3: R419.2 U400.C9(PA11)
EDBG_ADC0: U400.K10(PA21_/_PX22) ; port EDBG_ADC0
EDBG_CDC_USART_RX: U400.F9(PA03) ; port EDBG_CDC_UART.TXD
EDBG_CDC_USART_TX: R414.2 U400.E9(PA04)
EDBG_DGI_SCL: U400.F7(PA26_/_PB05) ; port EDBG_DGI_TWI.SCL
EDBG_DGI_SDA: U400.G7(PA12_/_PA25) ; port EDBG_DGI_TWI.SDA
EDBG_FORCE_BOOT: TP401.1 U400.H9(PA20_/_PX18)
EDBG_JTAG_TCK: TP402.1 U400.K9(TCK)
EDBG_JTAG_TDI: TP403.1 U400.K8(TDI)
EDBG_JTAG_TDO: TP404.1 U400.J8(TDO)
EDBG_JTAG_TMS: TP405.1 U400.H7(TMS)
EDBG_RESET_N: TP406.1 U400.J9(RESET_N)
EDBG_SPI_DGI_MISO: R420.1 U400.K2(PX27)
EDBG_SPI_DGI_MOSI: U400.K3(PX28) ; port EDBG_DGI_SPI.MOSI
EDBG_SPI_DGI_SCK: U400.J4(PX29) ; port EDBG_DGI_SPI.SCK
EDBG_SPI_DGI_SS: U400.G5(PX30) ; port EDBG_DGI_SPI.SS
EDBG_USB_FS_N: R421.2 U400.B9(DMFS)
EDBG_USB_FS_P: R422.2 U400.B8(DPFS)
EDBG_USB_HS_N: D402.3(I/O_2) J400.2(D-) R421.1 U400.A9(DMHS)
EDBG_USB_HS_P: D402.2(I/O_1) J400.3(D+) R422.1 U400.A8(DPHS)
ID1: R409.1 U400.A1(PA28) ; port ID_SYS.ID_1
ID3: R401.1 U400.B3(PB02) ; port ID_SYS.ID_3
POWER_LED_CTRL: Q400.2(G2) R410.1 U400.K4(PX15_/_PX32)
Shield: C403.2 J400.6(SHIELD1) J400.7(SHIELD2) J400.8(SHIELD3) J400.9(SHIELD4) R424.2
STATUS_LED_CTRL: Q400.5(G1) R413.2 U400.F1(PX19__/_PX59)
SWCLK: U400.D6(PB07) ; port EDBG_SWD.SWCLK
SWDIO: U400.C5(PB09) ; port EDBG_SWD.SWDIO
TARGET_RESET_EDBG: U400.B4(PA29) ; port EDBG_SWD.TARGET_RESET
TARGET_RESET_SENSE: U400.H2(PX21) ; port TARGET_RESET_SENSE
XIN0: C400.1 U400.A5(PC02) XC400.1
XOUT0: C401.1 U400.A6(PC03) XC400.3
NetC402_1: C402.1 R423.2 U400.C7(USB_VBIAS)
NetC404_1: C404.1 L402.2 U400.J6(VDDANA)
NetC405_1: C405.1 C406.1 U400.E10(VDDCORE)
NetC407_1: C407.1 D402.4(VCC) J400.1(VBUS) L401.1
NetD400_1: D400.1(CATHODE) R411.2
NetD401_1: D401.1(CATHODE) R412.2
NetQ400_3: Q400.3(D1) R412.1
NetQ400_6: Q400.6(D2) R411.1
NetR313_1: R420.2 ; port EDBG_DGI_SPI.MISO
NetR317_1: R414.1 ; port EDBG_CDC_UART.RXD
NetR318_1: R416.1 ; port EDBG_DGI_GPIO.DGI_GPIO0
NetR319_1: R417.1 ; port EDBG_DGI_GPIO.DGI_GPIO1
NetR320_1: R418.1 ; port EDBG_DGI_GPIO.DGI_GPIO2
NetR321_1: R419.1 ; port EDBG_DGI_GPIO.DGI_GPIO3

Not connected (* = marked no-connect by the designer): J400 4(ID)*; U400 A2(PA27)* A3(PB04)* A4(PA30)* A7(PC05)* B1(PB00)* B2(PB01)* B7(PC04)* C1(PB11)* C2(PA31)* C4(PB03)* C6(PB08)* D1(PX12)* D2(PX10) D3(PX13)* D4(PX16_/_PX53)* D5(PB10)* D7(PB06)* E1(PA02_/_PX47)* E3(PX08)* E4(PX09)* E7(PA16)* E8(PA06_/_PA13)* F3(PX06)* F4(PX07)* G1(PX05)* G2(PX01)* G3(PX02)* G4(PX00)* G6(PA23_/_PX46)* G8(PA00_/_PA18)* G9(PA05)* G10(PA01_/_PA17)* H1(PX04)* H4(PX25)* H5(PX31)* H6(PA22_/_PX20)* H10(PA07_/_PA19)* J1(PX03)* J2(PX24)* J3(PX26)* J7(PA15_/_PX45)* J10(PA24_/_PX17)* K1(PX23)* K5(PC00_/_PX14)* K6(PC01)* K7(PA14_/_PX11)*; XC400 2* 4*

### Layout directives
differential pair: EDBG_USB_FS_N, EDBG_USB_FS_P, EDBG_USB_HS_N, EDBG_USB_HS_P

### Notes on the sheet
- (near TP400) Connect the test points during startup of the EDBG to force it into bootloader mode.
  The test points should be covered with solder so that it is easier to get a good contact.
- (near R420) Current limiter, 10mA @3.3V
- Programming interface of the embedded debugger. The test points will be connected by needles in the test fixture for programming. GND test point is TP400.
- Input filter on USB power input.
- Date:
- PAGE:
- of
- TITLE:
- Document number:
- Revision:

### Library data of the parts
C400 C401 = A01-0019: Ceramic capacitor, SMD 0402, NP0, 50V, +/-5%; PartGroup: Capacitors,Ceramic,SMD 0402; TemperatureRange: -55 - +125 deg C; AN: A01-0019; Value: 22p; Tolerance: 50V, +/-5%; Height: 0,550000011920929
C402 = A01-0015: as C300 on sheet SAMR21_Xplained_Pro_Crystals; AN: A01-0015; Value: 10p; Tolerance: 50V, +/-5%; Height: 0,550000011920929
C403 = A01-0046: as C302 on sheet SAMR21_Xplained_Pro_Target_MCU; AN: A01-0046; Tolerance: 25V, +/-10%; Height: 0.550000011920929
C404 C410-C413 = A01-0246: as C301 on sheet SAMR21_Xplained_Pro_Target_MCU; AN: A01-0246; Value: 100n; Tolerance: 16V, +/-10%; Height: 0,5
C405 C409 C414 C415 = A01-0300: Ceramic capacitor, SMD 0402, X5R, 6.3V, +/-20%; PartGroup: Capacitors,Ceramic,SMD 0402; Manufacturer: Kemet; MPN: C0402C225M9PAC; Tolerance: ±20%; TemperatureRange: -55°C to +85°C; AN: A01-0300; Height: 0,5
C406-C408 = A01-0321: Ceramic capacitor, SMD 0402, C0G, 50V, +/-5%; PartGroup: Capacitors,Ceramic,SMD 0402; Manufacturer: Murata; MPN: GRM1555C1H102JA01D; Tolerance: 5%; AN: A01-0321; Value: 1 nF C0G
D400 = A10-0018: LED, Green, Wave length=575nm, SMD 0805, ±70°; PartGroup: Opto,LEDs,SMD; Manufacturer: Everlight; TemperatureRange: -40 - +85 deg C; AN: A10-0018; Height: 1,10000002384186; MPN: EL17-21SYGC
D401 = A10-0019: as D301 on sheet SAMR21_Xplained_Pro_Target_MCU; AN: A10-0019; Height: 1,10000002384186
D402 = A06-0236: as D300 on sheet SAMR21_Xplained_Pro_Target_MCU; AN: A06-0236; Value: PRTR5V0U2X; PartType: Buy; Height: 1,10000002384186; MPN: PRTR5V0U2X
J400 = A08-1368: as J300 on sheet SAMR21_Xplained_Pro_Target_MCU; AN: A08-1368; Height: 2.59999990463257; MPN: 10104111-0001LF
L401 L402 = A03-0035: as L300 on sheet SAMR21_Xplained_Pro_Target_MCU; AN: A03-0035; Value: BLM18PG471SN1; Height: 0,800000011920929; MPN: BLM18PG471SN1
Q400 = A05-0051: Dual N-Channel MOSFET, 60V, 115mA cont,RDS(ON) < 7.5 Ohm @50mA@5V, SOT-363; PartGroup: Transistors,Small signal FET,SMD; Manufacturer: Fairchild; TemperatureRange: -65 to 150 deg C; AN: A05-0051; Height: 1,10000002384186; MPN: 2N7002DW
R401 R409 = A02-0212: Thick film resistor, SMD 0402, 1/16W, 1%; PartGroup: Resistors,SMD,0402 1%; TemperatureRange: -55 - +125 deg C; AN: A02-0212; Tolerance: 1 %; Height: 0.349999994039536
R410 R413 R424 = A02-0284: as R305 on sheet SAMR21_Xplained_Pro_Target_MCU; AN: A02-0284; Tolerance: 1 %
  R410 R413: Height: 0.349999994039536
  R424: Height: 0,349999994039536
R411 R412 R414 R416-R420 = A02-0200: as R303 on sheet SAMR21_Xplained_Pro_Target_MCU; AN: A02-0200; Tolerance: 1 %
  R411 R412: Height: 0.349999994039536
  R414 R416-R420: Height: 0,349999994039536
R421 R422 = A02-0178: as R302 on sheet SAMR21_Xplained_Pro_Target_MCU; AN: A02-0178; Tolerance: 1 %; Height: 0,349999994039536
R423 = A02-0539: Thick film resistor, SMD 0402, 1/16W, 1%; PartGroup: Resistors,SMD,0402 1%; TemperatureRange: -55 - +125 deg C; AN: A02-0539; Tolerance: 1%; Height: 0,349999994039536
R425 = A02-0163: Thick film resistor, SMD 0402, 1/16W, 1%; PartGroup: Resistors,SMD,0402 1%; TemperatureRange: -55 - +125 deg C; AN: A02-0163; Tolerance: 1 %; Height: 0.349999994039536
TP400-TP407 = A08-0004: as TP300 on sheet SAMR21_Xplained_Pro_Target_MCU; AN: A08-0004; Height: 0
U400 = A06-0736: AVR 32-bit RISC MCU; PartGroup: Integrated Circuits,MCU, MPU, DSP,AVR MCU; Manufacturer: ATMEL; TemperatureRange: -40 to +85 deg C; AN: A06-0736; Height: 1; MPN: AT32UC3A4256J-C1UR
XC400 = A07-0042: Fox FQ5032B 12.0MHz SMD crystal 738B-12; PartGroup: Frequency devices,Crystals,SMD; Manufacturer: Fox  Electronics; MPN: FQ5032B-12-C-C-C-200-1; Tolerance: 30PPM; AN: A07-0042; Value: 12.0MHz; Height: 1,20000004768372

## Sheet SAMR21_Xplained_Pro_Connectors.SchDoc: Extension connectors
size A3; Organization: ATMEL Norway; Address1: Vestre Rosten 79; Address2: N-7075 TILLER; Address3: NORWAY; DocumentNumber: A09-2127; Revision: 3; SheetNumber: 5; SheetTotal: 7; PageSetup: Record=PageOptions|CenterHorizontal=True|CenterVertical=True|PrintScale=1.01|XCorrection=1.00|YCorrection=1.00|PrintKind=1|BorderSize=5000000|LeftOffset=0|BottomOffset=0|Orientation=2|PaperLength=1000|PaperWidth=1000|Scale=100|PaperSource=7|PrintQuality=-4|MediaType=1|DitherType=10|PaperKind=A3 (297 x 420 mm)|PrintScaleMode=1
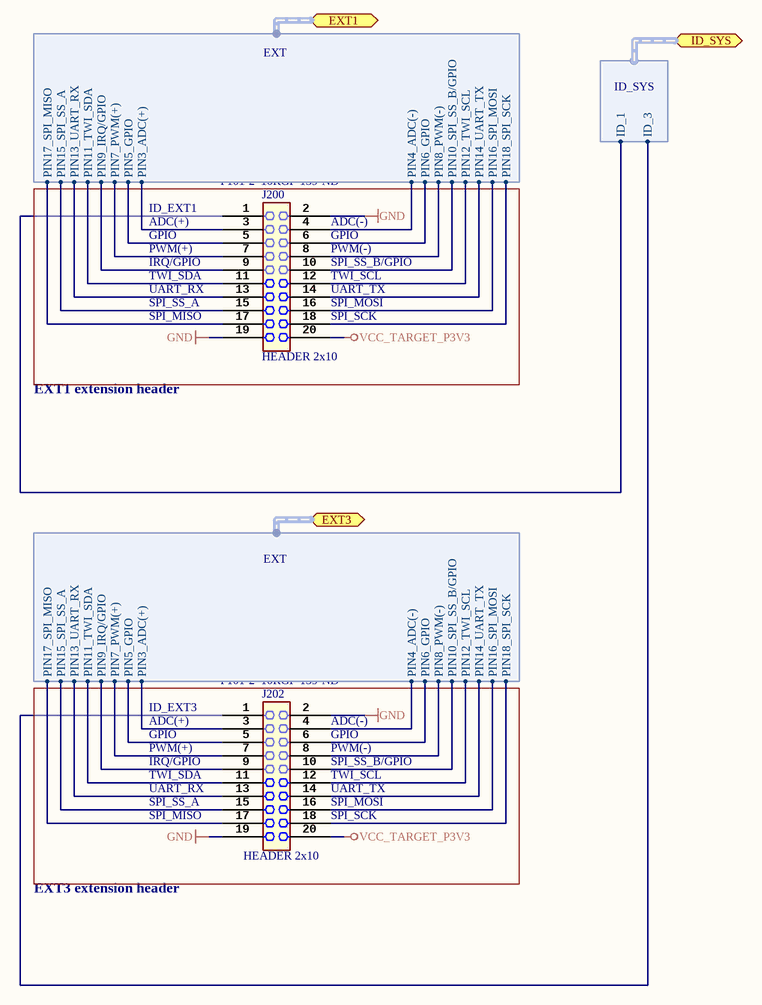
[diagram p4: SAMR21_Xplained_Pro_Connectors.SchDoc]

### Parts
J200  HEADER 2x10  value P101-2*10RGF-139-ND  [AP8-00622]
J202  HEADER 2x10  value P101-2*10RGF-139-ND  [AP8-00622]

### Ports
EXT1 (harness EXT), EXT3 (harness EXT), ID_SYS (harness ID_SYS)

### Harnesses
ID_SYS: ID_1, ID_3
EXT: PIN3_ADC(+), PIN4_ADC(-), PIN5_GPIO, PIN6_GPIO, PIN7_PWM(+), PIN8_PWM(-), PIN9_IRQ/GPIO, PIN10_SPI_SS_B/GPIO, PIN11_TWI_SDA, PIN12_TWI_SCL, PIN13_UART_RX, PIN14_UART_TX, PIN15_SPI_SS_A, PIN16_SPI_MOSI, PIN17_SPI_MISO, PIN18_SPI_SCK

### Nets
GND: J200.2 J200.19 J202.2 J202.19
VCC_TARGET_P3V3: J200.20 J202.20
ID1: J200.1 ; port ID_SYS.ID_1
ID3: J202.1 ; port ID_SYS.ID_3
PA04_S0_UART_TX: J200.14 ; port EXT1.PIN14_UART_TX
PA05_S0_UART_RX: J200.13 ; port EXT1.PIN13_UART_RX
PA06_ADC6: J200.3 ; port EXT1.PIN3_ADC(+)
PA08_GPIO: J202.10 ; port EXT3.PIN10_SPI_SS_B/GPIO
PA13_GPIO: J200.5 ; port EXT1.PIN5_GPIO
PA14_GPIO: J202.15 ; port EXT3.PIN15_SPI_SS_A
PA15_GPIO: J202.5 ; port EXT3.PIN5_GPIO
PA16_S1_I2C_SDA: J200.11 J202.11 ; port EXT1.PIN11_TWI_SDA, port EXT3.PIN11_TWI_SDA
PA17_S1_I2C_SCL: J200.12 J202.12 ; port EXT1.PIN12_TWI_SCL, port EXT3.PIN12_TWI_SCL
PA18_PWM_T0_W2: J200.7 ; port EXT1.PIN7_PWM(+)
PA19_PWM_T0_W3: J200.8 ; port EXT1.PIN8_PWM(-)
PA22_GPIO: J200.9 ; port EXT1.PIN9_IRQ/GPIO
PA23_GPIO: J200.10 ; port EXT1.PIN10_SPI_SS_B/GPIO
PA28_GPIO: J200.6 ; port EXT1.PIN6_GPIO
PB02_S5_SPI_MISO: J200.17 J202.17 ; port EXT1.PIN17_SPI_MISO, port EXT3.PIN17_SPI_MISO
PB03_S5_SPI_SS: J200.15 ; port EXT1.PIN15_SPI_SS_A
PB22_S5_SPI_MOSI: J200.16 J202.16 ; port EXT1.PIN16_SPI_MOSI, port EXT3.PIN16_SPI_MOSI
PB23_S5_SPI_SCK_EXT1: J200.18 ; port EXT1.PIN18_SPI_SCK
PB23_S5_SPI_SCK_EXT3: J202.18 ; port EXT3.PIN18_SPI_SCK
NetJ200_4: J200.4 ; port EXT1.PIN4_ADC(-)
NetJ202_3: J202.3 ; port EXT3.PIN3_ADC(+)
NetJ202_4: J202.4 ; port EXT3.PIN4_ADC(-)
NetJ202_6: J202.6 ; port EXT3.PIN6_GPIO
NetJ202_7: J202.7 ; port EXT3.PIN7_PWM(+)
NetJ202_8: J202.8 ; port EXT3.PIN8_PWM(-)
NetJ202_9: J202.9 ; port EXT3.PIN9_IRQ/GPIO
NetJ202_13: J202.13 ; port EXT3.PIN13_UART_RX
NetJ202_14: J202.14 ; port EXT3.PIN14_UART_TX

### Notes on the sheet
- ID_EXT1
- ADC(+)
- GPIO
- (near J200) ADC(-)
- (near J200) GPIO
- PWM(+)
- IRQ/GPIO
- TWI_SDA
- UART_RX
- SPI_SS_A
- SPI_MISO
- (near J200) PWM(-)
- (near J200) SPI_SS_B/GPIO
- (near J200) TWI_SCL
- (near J200) UART_TX
- (near J200) SPI_MOSI
- (near J200) SPI_SCK
- EXT1 extension header
- ID_EXT3
- (near J202) ADC(-)
- (near J202) GPIO
- (near J202) PWM(-)
- (near J202) SPI_SS_B/GPIO
- (near J202) TWI_SCL
- (near J202) UART_TX
- (near J202) SPI_MOSI
- (near J202) SPI_SCK
- EXT3 extension header
- Date:
- PAGE:
- of
- TITLE:
- Document number:
- Revision:

### Library data of the parts
J200 J202 = A08-1513: Pin header, 2x10, Right Angle, 2.54mm, THM, Pin In Paste; PartGroup: Mechanical devices,Connectors,Pin headers; AN: A08-1513; MPN: P101-2*10RGF-139-ND

## Sheet SAMR21_Xplained_Pro_triple_input_power_supply.SchDoc: Power supply
size A3; Organization: ATMEL Norway; Address1: Vestre Rosten 79; Address2: N-7075 TILLER; Address3: NORWAY; DocumentNumber: A09-2127; Revision: 3; SheetNumber: 6; SheetTotal: 7; PageSetup: Record=PageOptions|CenterHorizontal=True|CenterVertical=True|PrintScale=1.01|XCorrection=1.00|YCorrection=1.00|PrintKind=1|BorderSize=5000000|LeftOffset=0|BottomOffset=0|Orientation=2|PaperLength=1000|PaperWidth=1000|Scale=100|PaperSource=7|PrintQuality=-4|MediaType=1|DitherType=10|PaperKind=A3 (297 x 420 mm)|PrintScaleMode=1
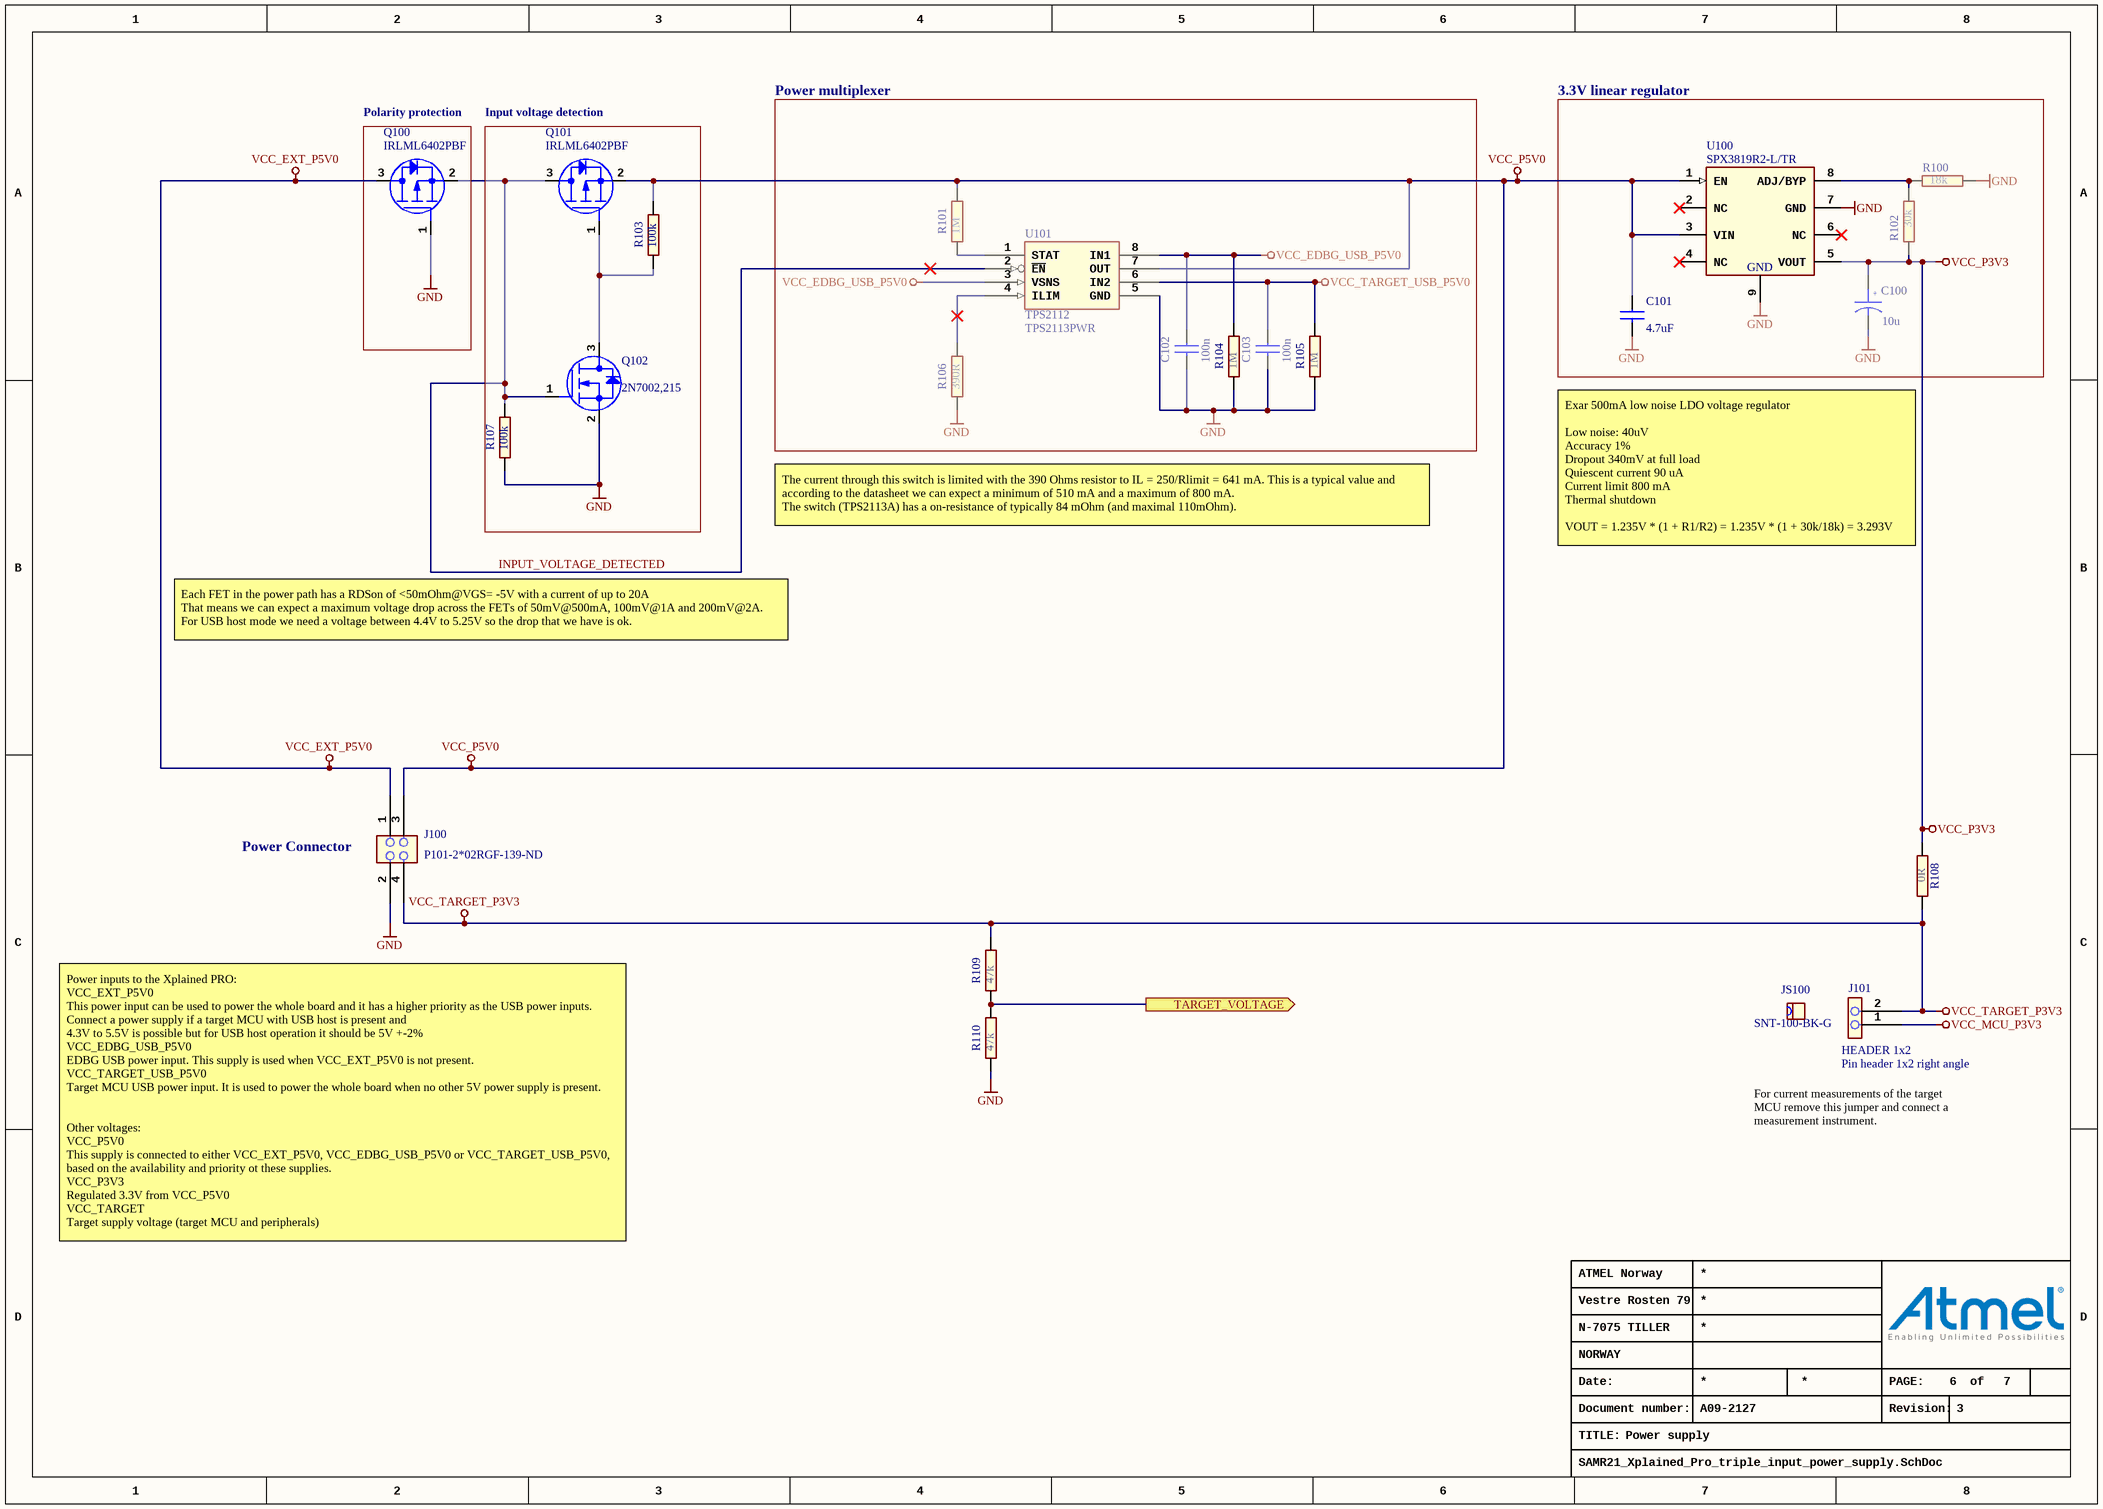
[diagram p5: SAMR21_Xplained_Pro_triple_input_power_supply.SchDoc]

### Parts
C100  value 10u  [AP1-00036]  (hidden comment: CAP-POL)
C101  value 4.7uF  [AP1-00039]  (hidden comment: CAP-NONPOL)
C102  value 100n  [AP1-00001]  (hidden comment: CAP-NONPOL)
C103  value 100n  [AP1-00001]  (hidden comment: CAP-NONPOL)
J100  value P101-2*02RGF-139-ND  [AP8-00628]  (hidden comment: HEADER 2x2)
J101  HEADER 1x2  value Pin header 1x2 right angle  [AP8-00367]
JS100  value SNT-100-BK-G  [AP8-00525]
Q100  value IRLML6402PBF  [AP5-00002]  (hidden comment: MOSFET_P_GSD)
Q101  value IRLML6402PBF  [AP5-00002]  (hidden comment: MOSFET_P_GSD)
Q102  value 2N7002,215  [AP5-00002]  (hidden comment: MOSFET_N_GSD)
R100  value 18k  [AP2-00000]  (hidden comment: R2)
R101  value 1M  [AP2-00000]  (hidden comment: R2)
R102  value 30k  [AP2-00000]  (hidden comment: R2)
R103  value 100k  [AP2-00000]  (hidden comment: R2)
R104  value 1M  [AP2-00000]  (hidden comment: R2)
R105  value 1M  [AP2-00000]  (hidden comment: R2)
R106  value 390R  [AP2-00000]  (hidden comment: R2)
R107  value 100k  [AP2-00000]  (hidden comment: R2)
R108  value 0R  [AP2-00000]  (hidden comment: R2)
R109  value 47k  [AP2-00000]  (hidden comment: R2)
R110  value 47k  [AP2-00000]  (hidden comment: R2)
U100  value SPX3819R2-L/TR  [AP6-00338]  (hidden comment: Mouser: 1016-1588-2-ND)
U101  TPS2112  value TPS2113PWR  [AP6-00054]

### Blocks framed on the sheet
Polarity protection: Q100
Input voltage detection: Q101 Q102 R103 R107
Power multiplexer: C102 C103 R101 R104-R106 U101
3.3V linear regulator: C100 C101 R100 R102 U100

### Ports
TARGET_VOLTAGE (out)

### Nets
GND: C100.2 C101.2 C102.2 C103.2 J100.2 Q100.1(G) Q102.2(S) R100.2 R104.1 R105.1 R106.1 R107.1 R110.1 U100.7(GND) U100.9(GND) U101.5(GND)
VCC_EDBG_USB_P5V0: C102.1 R104.2 U101.3(VSNS) U101.8(IN1)
VCC_EXT_P5V0: J100.1 Q100.3(D)
VCC_MCU_P3V3: J101.1
VCC_P3V3: C100.1 R102.1 R108.1 U100.5(VOUT)
VCC_P5V0: C101.1 J100.3 Q101.2(S) R101.2 R103.2 U100.1(EN) U100.3(VIN) U101.7(OUT)
VCC_TARGET_P3V3: J100.4 J101.2 R108.2 R109.2
VCC_TARGET_USB_P5V0: C103.1 R105.2 U101.6(IN2)
EDBG_ADC0: R109.1 R110.2 ; port TARGET_VOLTAGE
INPUT_VOLTAGE_DETECTED: Q100.2(S) Q101.3(D) Q102.1(G) R107.2 U101.2(~{EN})
NetQ101_1: Q101.1(G) Q102.3(D) R103.1
NetR100_1: R100.1 R102.2 U100.8(ADJ/BYP)
NetR101_1: R101.1 U101.1(STAT)
NetR106_2: R106.2 U101.4(ILIM)

Not connected (* = marked no-connect by the designer): U100 2(NC)* 4(NC)* 6(NC)*

### Notes on the sheet
- The current through this switch is limited with the 390 Ohms resistor to IL = 250/Rlimit = 641 mA. This is a typical value and according to the datasheet we can expect a minimum of 510 mA and a maximum of 800 mA.
  The switch (TPS2113A) has a on-resistance of typically 84 mOhm (and maximal 110mOhm).
- Exar 500mA low noise LDO voltage regulator
  Low noise: 40uV
  Accuracy 1%
  Dropout 340mV at full load
  Quiescent current 90 uA
  Current limit 800 mA
  Thermal shutdown
  VOUT = 1.235V * (1 + R1/R2) = 1.235V * (1 + 30k/18k) = 3.293V
- Each FET in the power path has a RDSon of <50mOhm@VGS= -5V with a current of up to 20A
  That means we can expect a maximum voltage drop across the FETs of 50mV@500mA, 100mV@1A and 200mV@2A.
  For USB host mode we need a voltage between 4.4V to 5.25V so the drop that we have is ok.
- (near J100) Power Connector
- For current measurements of the target MCU remove this jumper and connect a measurement instrument.
- Power inputs to the Xplained PRO:
  VCC_EXT_P5V0
  This power input can be used to power the whole board and it has a higher priority as the USB power inputs. Connect a power supply if a target MCU with USB host is present and
  4.3V to 5.5V is possible but for USB host operation it should be 5V +-2%
  VCC_EDBG_USB_P5V0
  EDBG USB power input. This supply is used when VCC_EXT_P5V0 is not present.
  VCC_TARGET_USB_P5V0
  Target MCU USB power input. It is used to power the whole board when no other 5V power supply is present.
  Other voltages:
  VCC_P5V0
  This supply is connected to either VCC_EXT_P5V0, VCC_EDBG_USB_P5V0 or VCC_TARGET_USB_P5V0, based on the availability and priority ot these supplies.
  VCC_P3V3
  Regulated 3.3V from VCC_P5V0
  VCC_TARGET
  Target supply voltage (target MCU and peripherals)
- Date:
- PAGE:
- of
- TITLE:
- Document number:
- Revision:
- (in symbol A01-0324) +

### Library data of the parts
C100 = A01-0324: SMD tantalum capacitor, ESR = 1.7, 3216-18 (EIA) 1206,; PartGroup: Capacitors,Tantalum; Manufacturer: vishay; MPN: TR3A106K016C1700; Tolerance: +-10%; TemperatureRange: -55°C ~ 85°C; AN: A01-0324; Height: 1.60000002384186
C101 = A01-0377: Ceramic capacitor, SMD 0603, X5R, 10V, 10% (de31036); PartGroup: Capacitors,Ceramic,SMD 0603; Manufacturer: tdk; MPN: C1608X5R1A475K; TemperatureRange: -55 - +85 deg C; AN: A01-0377; Tolerance: 10%; Height: 0.800000011920929
C102 C103 = A01-0246: as C301 on sheet SAMR21_Xplained_Pro_Target_MCU; AN: A01-0246; Tolerance: 16V, +/-10%; Height: 0.5
J100 = A08-1519: Pin header, 2x2, Right Angle, 2.54mm, THT, Pin In Paste; PartGroup: Mechanical devices,Connectors,Pin headers; AN: A08-1519; Height: 5.07999992370605; MPN: P101-2*02RGF-139-ND
J101 = A08-0764: 1x2 pin header, right angle, 2.54 mm pitch, through-hole; PartGroup: Mechanical devices,Connectors,Pin headers; Manufacturer: Pro-data International Corp; MPN: 2213R-2G; AN: A08-0764; Height: 2.53999996185303
JS100 = A08-0543: Jumper cap for 2.54mm pinheader; PartGroup: Mechanical devices,Mounting accessories,Other; Manufacturer: SAMTEC; AN: A08-0543; MPN: SNT-100-BK-G
Q100 Q101 = A05-0087: P-ch. MOSFET. -30V, -3.7A continuous,RDS(ON)=0.05Ohm@VGS=-4,5V, RDS(ON)=0.08Ohm@VGS=-2.5V; PartGroup: Transistors,Power FET,SMD; Manufacturer: International Rectifier; TemperatureRange: -55 - +150 deg C; AN: A05-0087; Height: 1.14999997615814; MPN: IRLML6402PBF
Q102 = A05-0085: N-Channel MOSFET. 60V, 0.300A continuous, 1.2A Peak. RDS(ON) = 3.8Ohm@VGS=4.5V, VGS(th)<2.5V; PartGroup: Transistors,Small signal FET,SMD; Manufacturer: NXP; TemperatureRange: -65 to 150 deg C; AN: A05-0085; Height: 1.10000002384186; MPN: 2N7002,215
R100 = A02-0242: Thick film resistor, SMD 0402, 1/16W, 1%; PartGroup: Resistors,SMD,0402 1%; TemperatureRange: -55 - +125 deg C; AN: A02-0242; Tolerance: 1 %; Height: 0.349999994039536
R101 R104 R105 = A02-0284: Thick film resistor, SMD 0402, 1/16W, 1%; PartGroup: Resistors,SMD,0402 1%; TemperatureRange: -55 - +125 deg C; AN: A02-0284; Tolerance: 1 %; Height: 0.349999994039536
R102 = A02-0247: Thick film resistor, SMD 0402, 1/16W, 1%; PartGroup: Resistors,SMD,0402 1%; TemperatureRange: -55 - +125 deg C; AN: A02-0247; Tolerance: 1 %; Height: 0.349999994039536
R103 R107 = A02-0260: as R300 on sheet SAMR21_Xplained_Pro_Target_MCU; AN: A02-0260; Tolerance: 1 %; Height: 0.349999994039536
R106 = A02-0202: Thick film resistor, SMD 0402, 1/16W, 1%; PartGroup: Resistors,SMD,0402 1%; TemperatureRange: -55 - +125 deg C; AN: A02-0202; Tolerance: 1 %; Height: 0.349999994039536
R108 = A02-0163: as R425 on sheet SAMR21_Xplained_Pro_EDBG; AN: A02-0163; Tolerance: 1 %; Height: 0.349999994039536
R109 R110 = A02-0252: as R328 on sheet SAMR21_Xplained_Pro_Target_MCU; AN: A02-0252; Tolerance: 1 %; Height: 0.349999994039536
U100 = A06-0957: 500mA LDO, ADJ, low noise, 8-DFN package; PartGroup: Integrated Circuits,Regulators,Linear; Manufacturer: Exar; Tolerance: ±1%; TemperatureRange: -40°C to +125°C; AN: A06-0957; Height: 0.899999976158142; MPN: SPX3819R2-L/TR
U101 = A06-0068: Autoswitching 2:1 Power Mux; PartGroup: Integrated Circuits,General linear,Analog switch, bus switch and MUX; Manufacturer: Texas Instruments; TemperatureRange: -40 - + 125 deg C; AN: A06-0068; Height: 1.20000004768372; MPN: TPS2113PWR